# EAGLE board STEP800_proto_r3 (EAGLE 9.5.2), part 1 of 3
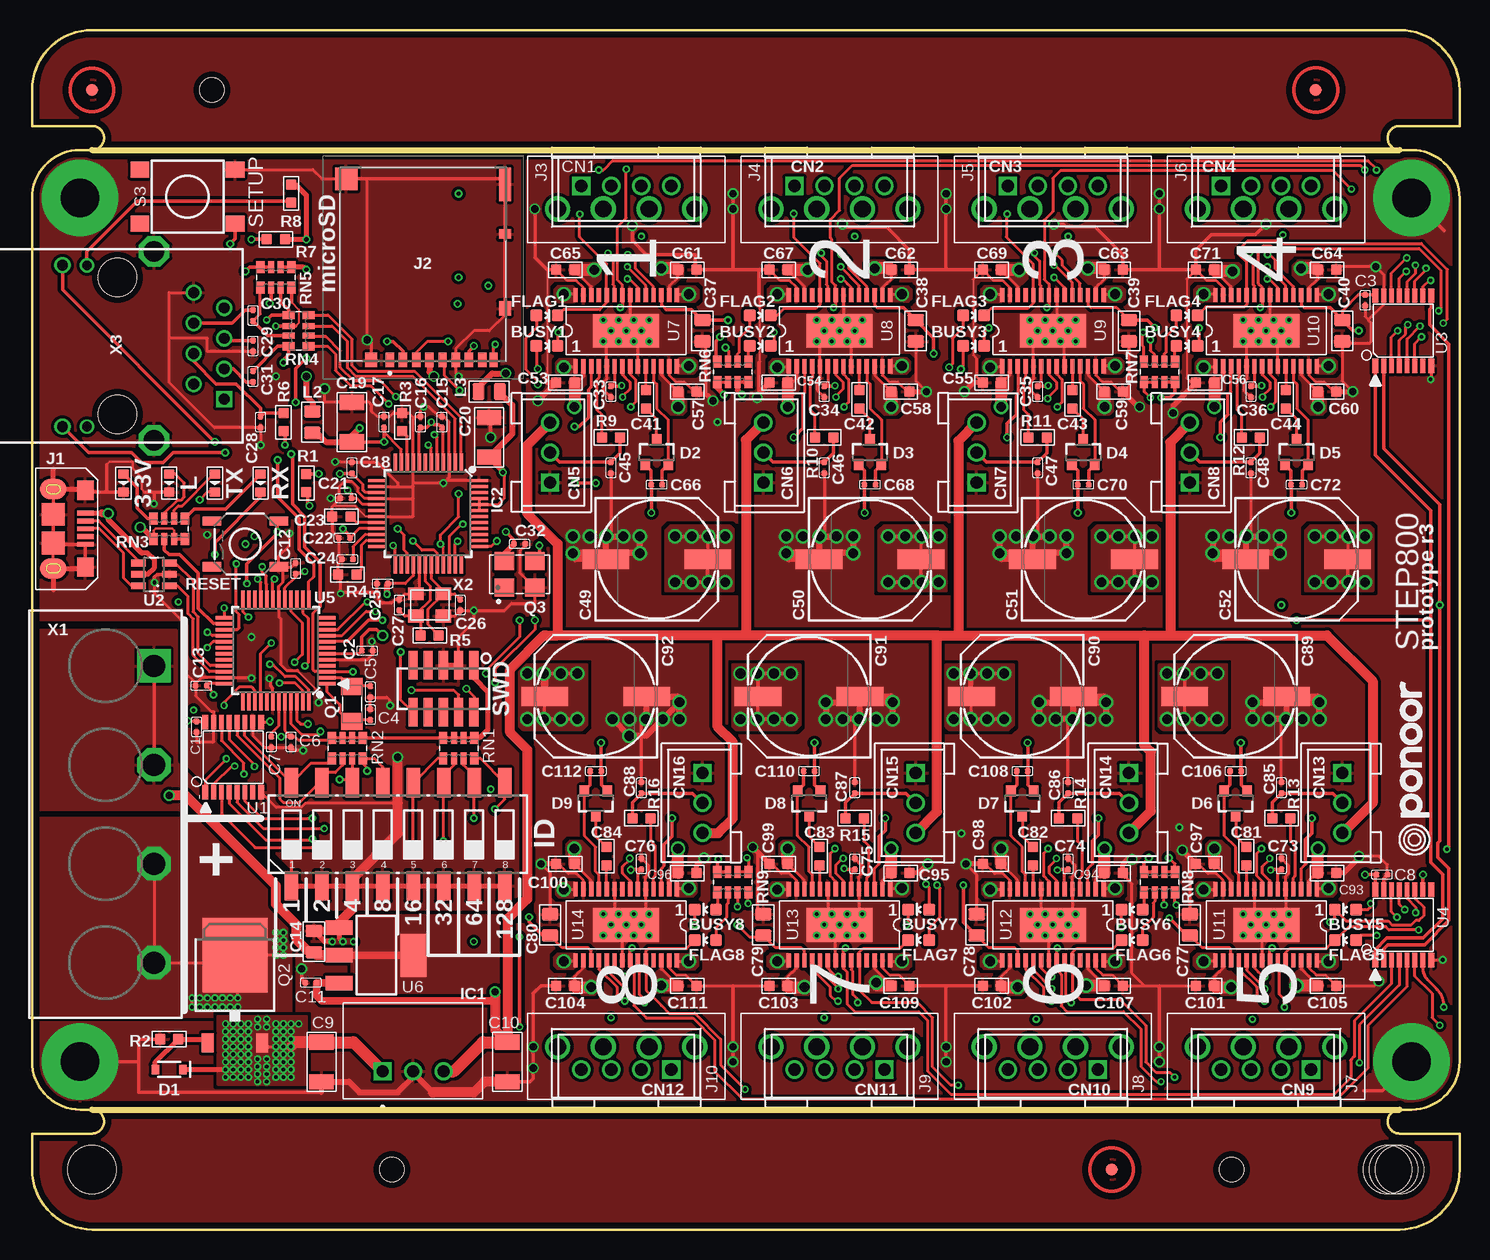
[diagram p3: board, top side]
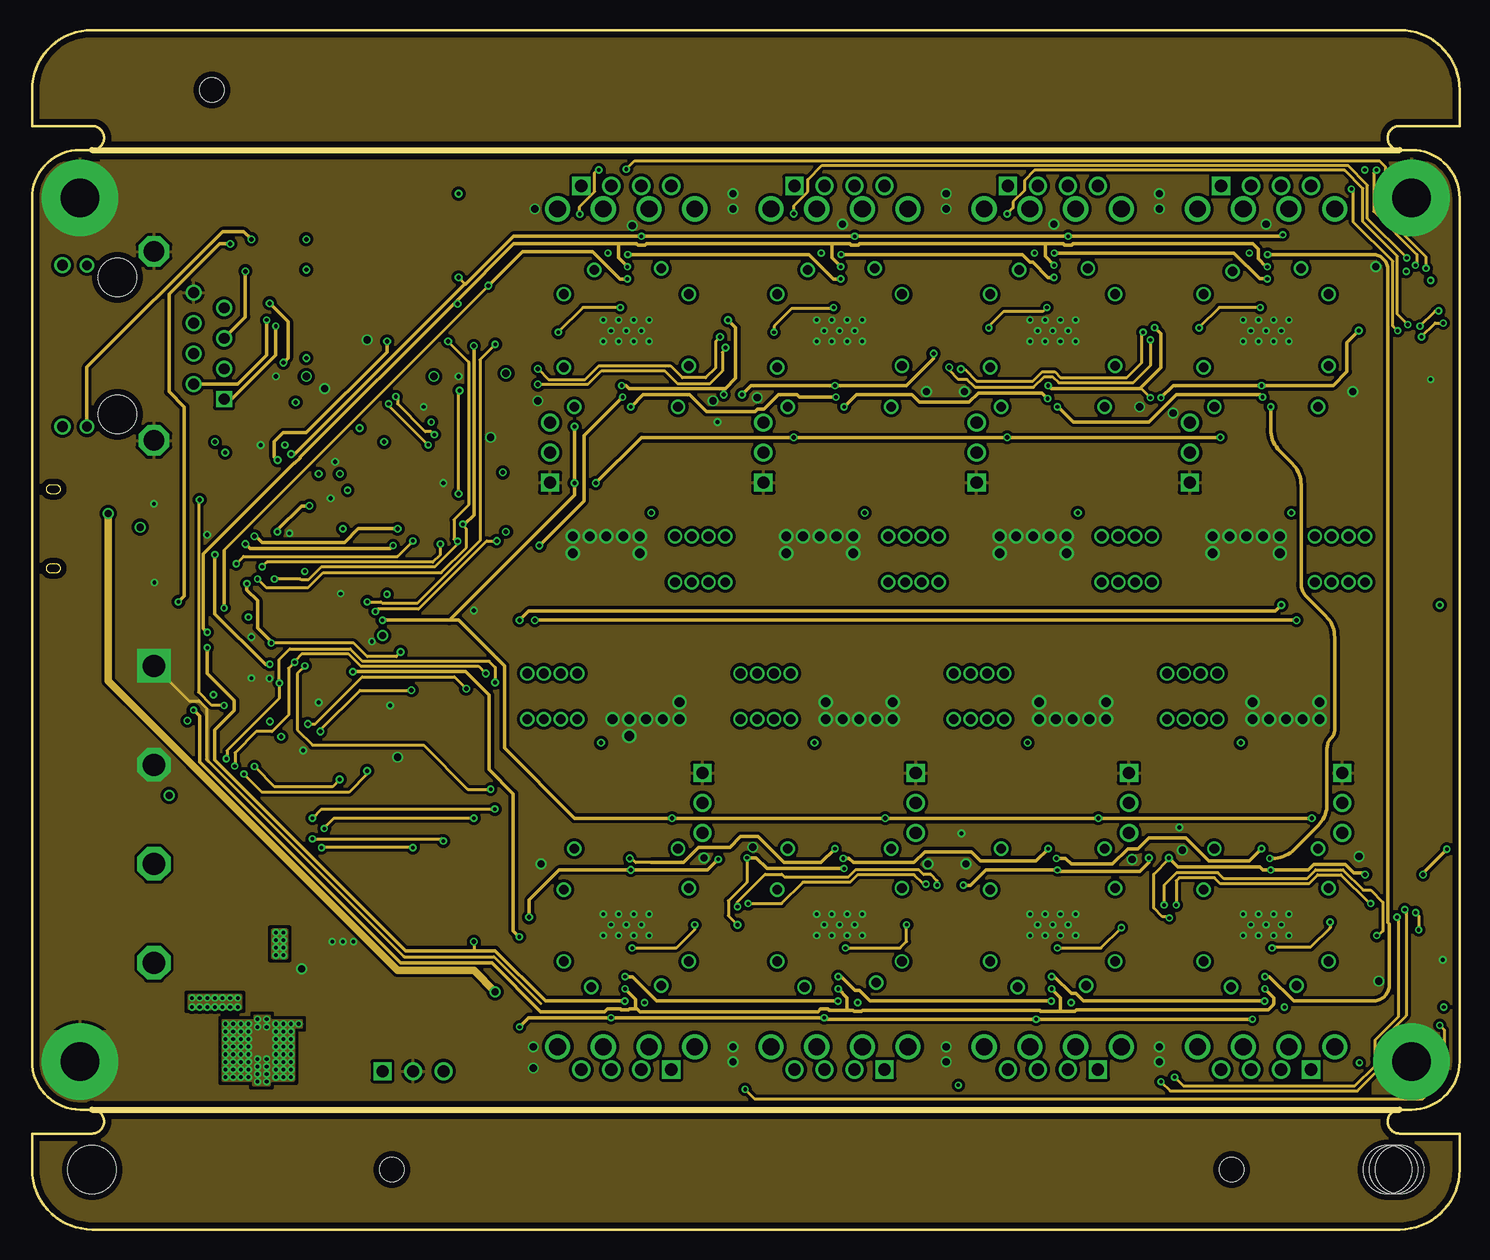
[diagram p4: board, inner layer Route2]
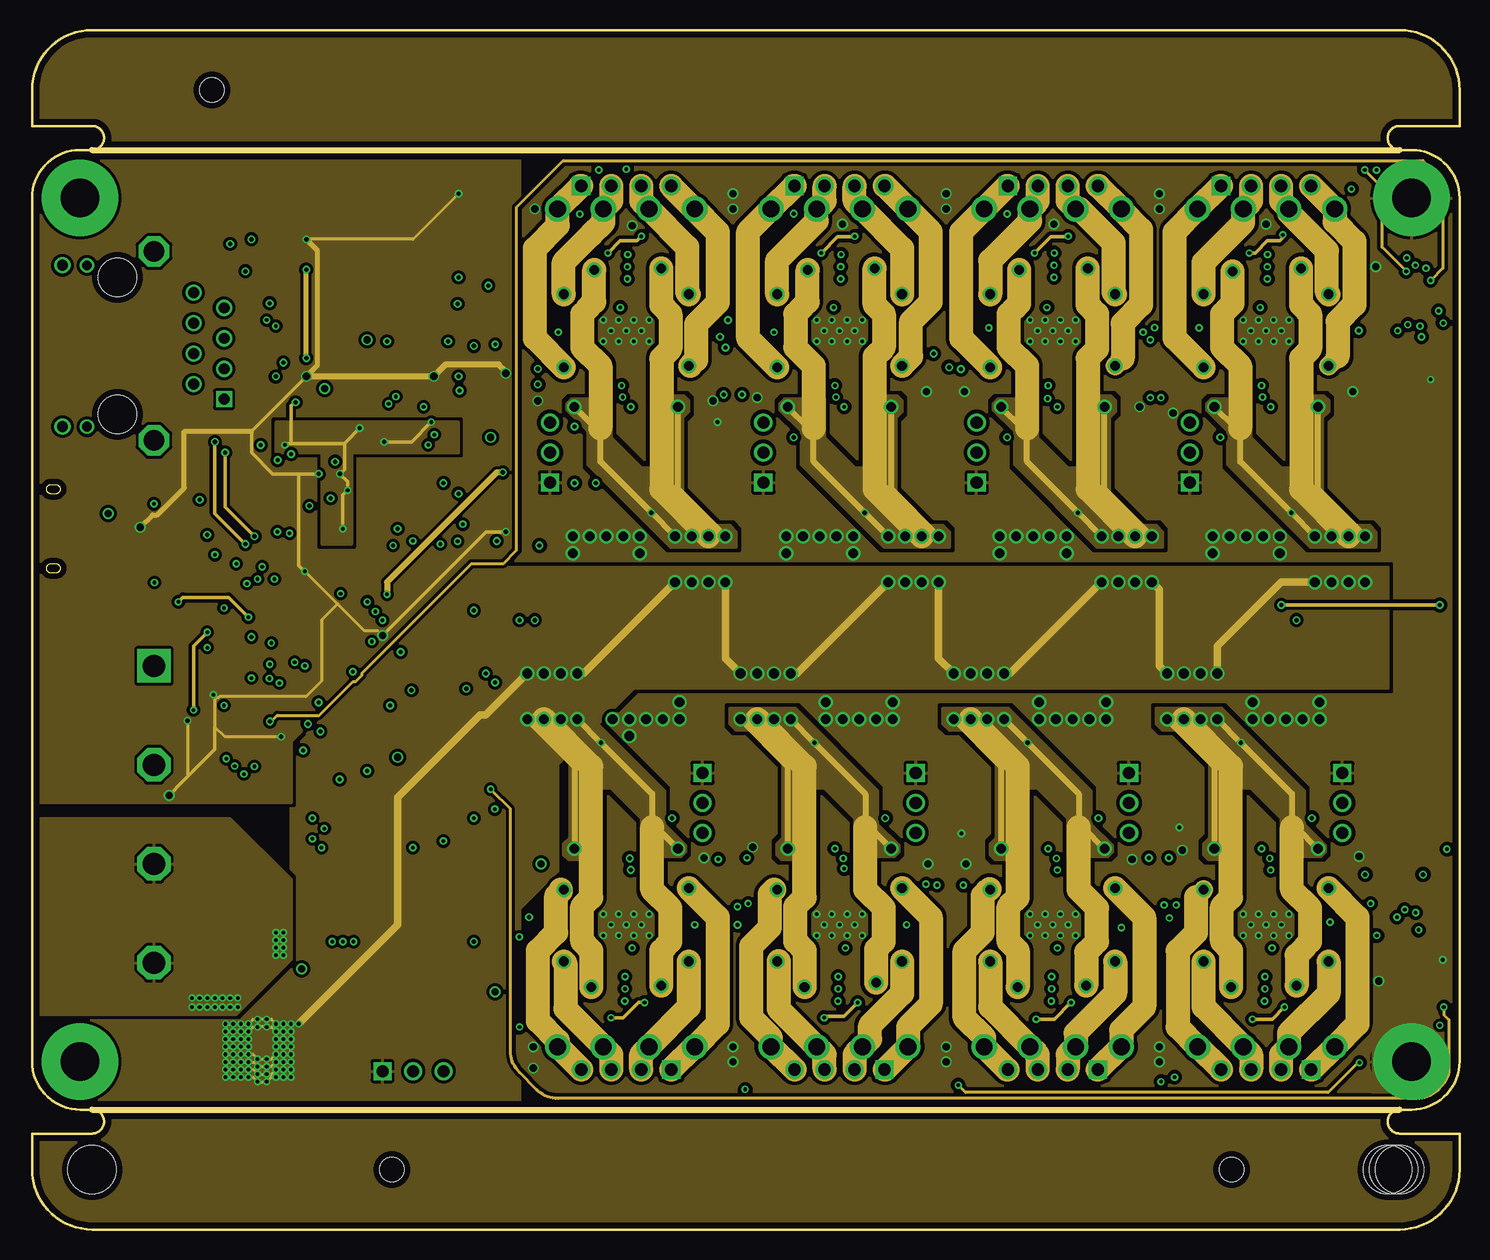
[diagram p5: board, inner layer Route15]
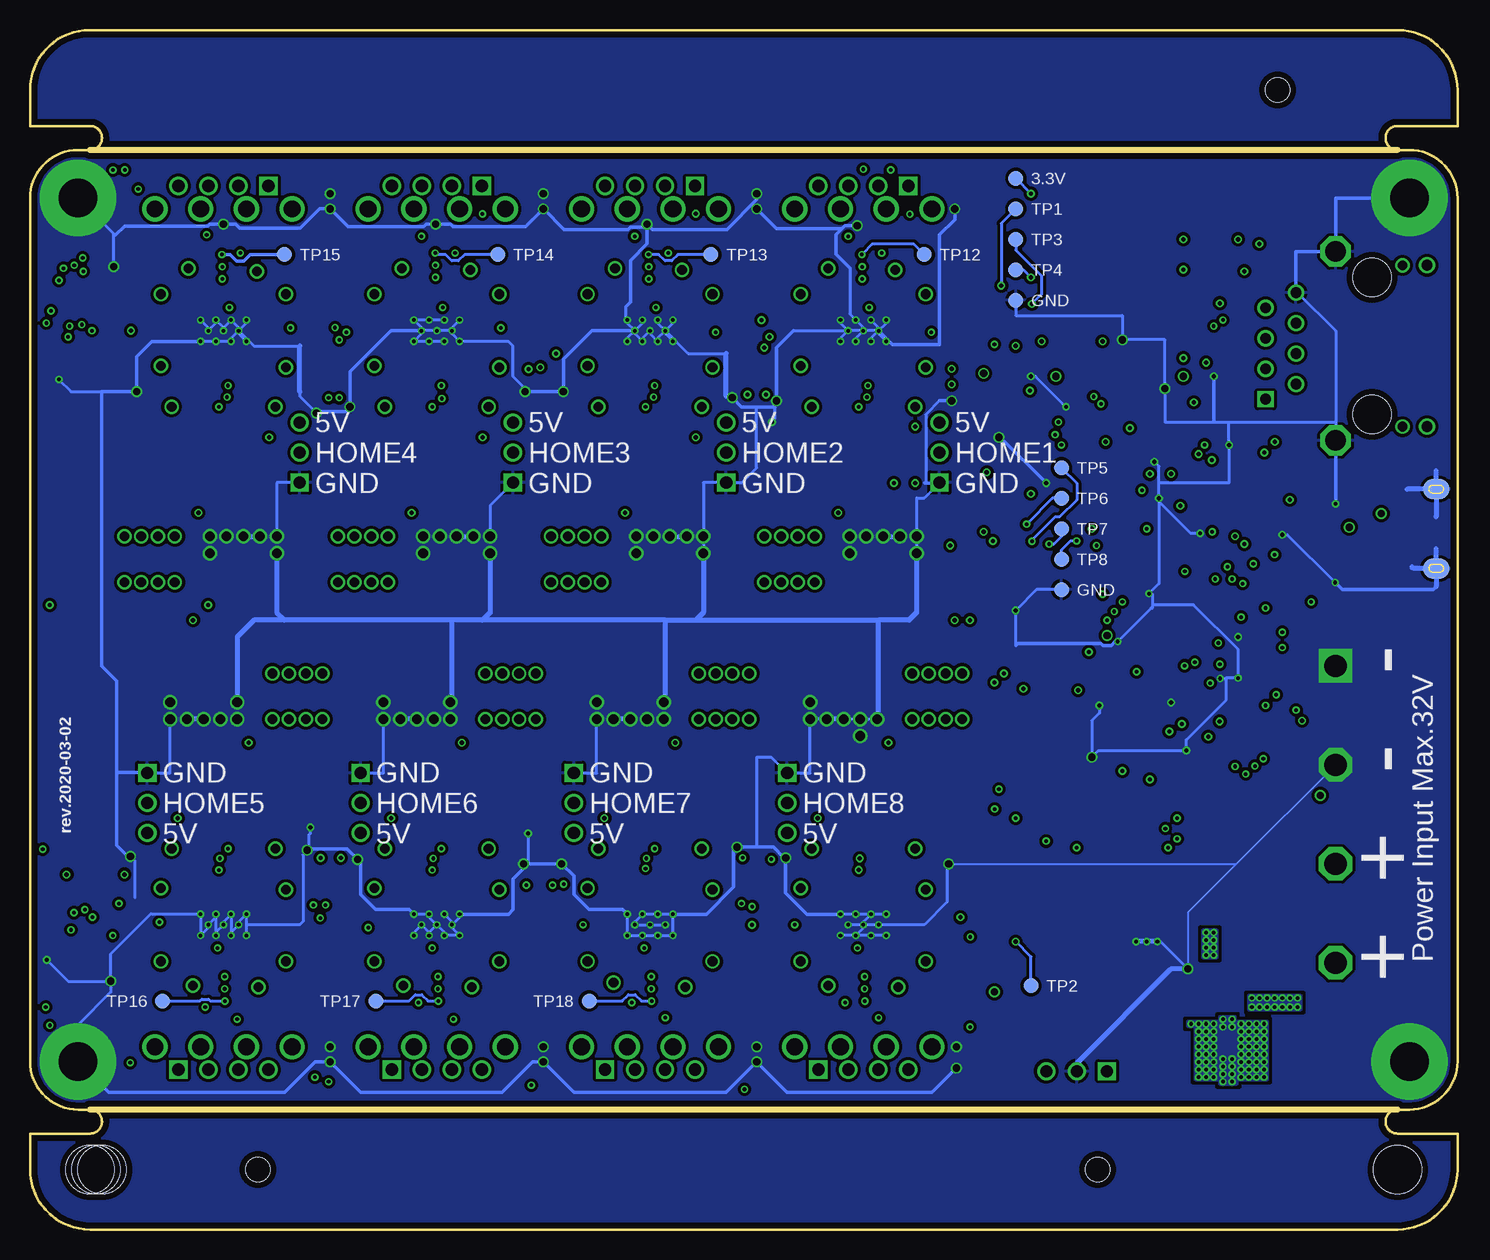
[diagram p6: board, bottom side, seen from below]

Size 119 x 100 mm. Coordinates in mm from the lower left corner, seen from the top.
Outline: 5,90 114,90
Outline: 5,10 114,10
Outline: 5,90 arc90 6,91 arc90 5,92 0,92 0,95 arc-90 5,100 114,100 arc-90 119,95 119,92 114,92 arc90 113,91 arc90 114,90
Outline: 5,90 4,90 arc90 0,86 0,14 arc90 4,10 5,10
Outline: 5,10 arc-90 6,9 arc-90 5,8 0,8 0,5 arc90 5,0 114,0 arc90 119,5 119,8 114,8 arc-90 113,9 arc-90 114,10
Outline: 114,10 115,10 arc90 119,14 119,86 arc90 115,90 114,90
Copper layers (1+2*15+16): Top 0.018mm / dielectric 0.25mm / Route2 0.035mm / dielectric 1mm / Route15 0.035mm / dielectric 0.25mm / Bottom 0.018mm
Design rules "pban_5mil-l4": minimum track width 5mil, minimum drill 0.3mm, track to track 5mil, track to pad 0.229mm, pad to pad 5mil, via to via 5mil, smd to smd 5mil, copper to edge 0.5mm, drill to drill 0.5mm, minimum pad ring 0.15mm, minimum via ring 0.15mm, stop-mask expansion 4mil, vias tented up to drill 0.35mm, thermal gap 10mil
Holes 2.05 mm at 15,95 100,5 30,5
Holes 4 mm at 5,5 114,5 113,5 113.5,5
tRestrict: area 3.3,93.3 to 6.7,96.7; area 88.3,3.3 to 91.7,6.7; area 105.3,93.3 to 108.7,96.7

## Footprints (pad centres in the part's own frame; a part is rotated, then mirrored left to right if it is on the bottom)
LED-0603 = smd 0.762 x 0.889: + -0.762,0; - 0.762,0
LED-0603' = smd 1 x 1: A 0,-0.877; C 0,0.877
C0402 = smd 0.5 x 0.5: 1 0,0.463; 2 0,-0.463
C1206 = smd 1.27 x 2.032: 1 -1.651,0; 2 1.651,0
C0805 = smd 1.397 x 1.016: 1 0,0.889; 2 0,-0.889
C0603 = smd 0.889 x 0.889: 1 0,0.762; 2 0,-0.762
NICHICON_D10 = smd 3.9 x 1.6: + 4.25,0; - -4.25,0
B4B-XASK-1 = drill 1.016 square: 1 -3.75,0 | drill 1.016: 2 -1.25,0; 3 1.25,0; 4 3.75,0
B3B-XASK-1 = drill 1.016 square: 1 -2.5,0 | drill 1.016: 2 0,0; 3 2.5,0
SOD-323 = smd 0.63 x 0.83: A 1.15,0; C -1.15,0
SOT23-3 = smd 0.8 x 0.9: 1 -0.95,-1; 2 0.95,-1; 3 0,1.1
FIDUCIAL-1X2 = smd 1 x 1: 1 0,0
CONV_P78E05-1000 = drill 1 square: 1 -2.54,0 | drill 1: 2 0,0; 3 2.54,0
TQFP48-LONG = smd 1.5 x 0.28: 1 -4.25,2.75; 2 -4.25,2.25; 3 -4.25,1.75; 4 -4.25,1.25; 5 -4.25,0.75; 6 -4.25,0.25; 7 -4.25,-0.25; 8 -4.25,-0.75; 9 -4.25,-1.25; 10 -4.25,-1.75; 11 -4.25,-2.25; 12 -4.25,-2.75; 25 4.25,-2.75; 26 4.25,-2.25; 27 4.25,-1.75; 28 4.25,-1.25; 29 4.25,-0.75; 30 4.25,-0.25; 31 4.25,0.25; 32 4.25,0.75; 33 4.25,1.25; 34 4.25,1.75; 35 4.25,2.25; 36 4.25,2.75 | smd 0.28 x 1.5: 13 -2.75,-4.25; 14 -2.25,-4.25; 15 -1.75,-4.25; 16 -1.25,-4.25; 17 -0.75,-4.25; 18 -0.25,-4.25; 19 0.25,-4.25; 20 0.75,-4.25; 21 1.25,-4.25; 22 1.75,-4.25; 23 2.25,-4.25; 24 2.75,-4.25; 37 2.75,4.25; 38 2.25,4.25; 39 1.75,4.25; 40 1.25,4.25; 41 0.75,4.25; 42 0.25,4.25; 43 -0.25,4.25; 44 -0.75,4.25; 45 -1.25,4.25; 46 -1.75,4.25; 47 -2.25,4.25; 48 -2.75,4.25
CTS-219-08 = smd 1.13 x 2.44: 1 -8.89,-4.3; 2 -6.35,-4.3; 3 -3.81,-4.3; 4 -1.27,-4.3; 5 1.27,-4.3; 6 3.81,-4.3; 7 6.35,-4.3; 8 8.89,-4.3; 9 8.89,4.3; 10 6.35,4.3; 11 3.81,4.3; 12 1.27,4.3; 13 -1.27,4.3; 14 -3.81,4.3; 15 -6.35,4.3; 16 -8.89,4.3
MICROUSB-FCI-PBAN = smd 0.4 x 1.35: 1 -1.3,1.27; 2 -0.65,1.27; 3 0,1.27; 4 0.65,1.27; 5 1.3,1.27 | smd 1.7 x 2.2: S1 -3.3,-1.4; S2 3.3,-1.4 | smd 1.6 x 1.4: S3 -3.2,1.27; S4 3.2,1.27 | smd 1.9 x 1.9: S5 -1.2,-1.405; S6 1.2,-1.405 | smd 1.7 x 2.2 bottom: S7 -3.3,-1.4; S8 3.3,-1.4
DM3ATSFPEJM542 = smd 0.7 x 1.2: 1 3.2,-0.1; 2 2.1,-0.1; 3 1,-0.1; 4 -0.1,-0.1; 5 -1.2,-0.1; 6 -2.3,-0.1; 7 -3.4,-0.1; 8 -4.5,-0.1; 9 -5.45,-0.1 | smd 1 x 1.2: 10 4.75,-0.1; 14 -6.4,-4.4 | smd 1.85 x 1.9: 11 6.825,-15.2 | smd 1 x 2.8: 12 -6.4,-14.75 | smd 1 x 0.8: 13 -6.4,-10.6
691321300004 = drill 1.4: 1 -5.715,0; 2 -1.905,0; 3 1.905,0; 4 5.715,0
L0805 = smd 1.016 x 1.397: 1 -0.889,0; 2 0.889,0
FC-135 = smd 1.4 x 1.8: P$1 -1.45,0; P$2 1.45,0
TO252 = smd 1 x 1.6: 1 -2.28,-4.8; 2 2.28,-4.8 | smd 5.4 x 6.2: 3 0,2.5
SG5032 = smd 1.5 x 1.6: 1 -1.1,1.27; 2 -1.1,-1.27; 3 1.1,-1.27; 4 1.1,1.27
R0603 = smd 0.889 x 0.889: 1 0,0.762; 2 0,-0.762
TACTILE-SWITCH-SMD = smd 1.524 x 0.762: 1 -2.794,1.905; 2 2.794,1.905; 3 -2.794,-1.905; 4 2.794,-1.905
CAY16_LONG_W = smd 0.7 x 1: 1 -1.3,-0.85; 4 1.3,-0.85; 5 1.3,0.85; 8 -1.3,0.85 | smd 0.5 x 1: 2 -0.4,-0.85; 3 0.4,-0.85; 6 0.4,0.85; 7 -0.4,0.85
TACTILE_SWITCH_SMD_6.2MM_TALL = smd 1.55 x 1.3: A1 -3.975,-2.25; A2 3.975,-2.25; B1 -3.975,2.25; B2 3.975,2.25
STANDOFF-ELECTRICAL = drill 3.2 pad 6.35: P1 0,0
20021121-00010C4LF = smd 0.762 x 2.388: P$1 -2.54,-1.956; P$2 -2.54,1.956; P$3 -1.27,-1.956; P$4 -1.27,1.956; P$5 0,-1.956; P$6 0,1.956; P$7 1.27,-1.956; P$8 1.27,1.956; P$9 2.54,-1.956; P$10 2.54,1.956
PAD.03X.05 = smd 1.27 x 1.27: P$1 0,0
TSSOP16 = smd 0.5 x 1.2: 1 -2.325,-2.925; 8 2.325,-2.925; 9 2.325,2.925; 16 -2.325,2.925 | smd 0.4 x 1.2: 2 -1.625,-2.925; 3 -0.975,-2.925; 4 -0.325,-2.925; 5 0.325,-2.925; 6 0.975,-2.925; 7 1.625,-2.925; 10 1.625,2.925; 11 0.975,2.925; 12 0.325,2.925; 13 -0.325,2.925; 14 -0.975,2.925; 15 -1.625,2.925
SOT23-6L = smd 0.55 x 1.2: 1 -0.95,-1.3; 2 0,-1.3; 3 0.95,-1.3; 4 0.95,1.3; 5 0,1.3; 6 -0.95,1.3
TQFP-48 = smd 1.5 x 0.28: 1 -4.25,2.75; 2 -4.25,2.25; 3 -4.25,1.75; 4 -4.25,1.25; 5 -4.25,0.75; 6 -4.25,0.25; 7 -4.25,-0.25; 8 -4.25,-0.75; 9 -4.25,-1.25; 10 -4.25,-1.75; 11 -4.25,-2.25; 12 -4.25,-2.75; 25 4.25,-2.75; 26 4.25,-2.25; 27 4.25,-1.75; 28 4.25,-1.25; 29 4.25,-0.75; 30 4.25,-0.25; 31 4.25,0.25; 32 4.25,0.75; 33 4.25,1.25; 34 4.25,1.75; 35 4.25,2.25; 36 4.25,2.75 | smd 0.28 x 1.5: 13 -2.75,-4.25; 14 -2.25,-4.25; 15 -1.75,-4.25; 16 -1.25,-4.25; 17 -0.75,-4.25; 18 -0.25,-4.25; 19 0.25,-4.25; 20 0.75,-4.25; 21 1.25,-4.25; 22 1.75,-4.25; 23 2.25,-4.25; 24 2.75,-4.25; 37 2.75,4.25; 38 2.25,4.25; 39 1.75,4.25; 40 1.25,4.25; 41 0.75,4.25; 42 0.25,4.25; 43 -0.25,4.25; 44 -0.75,4.25; 45 -1.25,4.25; 46 -1.75,4.25; 47 -2.25,4.25; 48 -2.75,4.25
SOT223 = smd 1.219 x 2.235: 1 -2.311,-3.099; 2 0,-3.099; 3 2.311,-3.099 | smd 3.6 x 2.2: 4 0,3.099
HTSSOP28_VIA = smd 0.36 x 1.19: 1 -4.225,-2.97; 2 -3.575,-2.97; 3 -2.925,-2.97; 4 -2.275,-2.97; 5 -1.625,-2.97; 6 -0.975,-2.97; 7 -0.325,-2.97; 8 0.325,-2.97; 9 0.975,-2.97; 10 1.625,-2.97; 11 2.275,-2.97; 12 2.925,-2.97; 13 3.575,-2.97; 14 4.225,-2.97; 15 4.225,2.97; 16 3.575,2.97; 17 2.925,2.97; 18 2.275,2.97; 19 1.625,2.97; 20 0.975,2.97; 21 0.325,2.97; 22 -0.325,2.97; 23 -0.975,2.97; 24 -1.625,2.97; 25 -2.275,2.97; 26 -2.925,2.97; 27 -3.575,2.97; 28 -4.225,2.97 | smd 5.5 x 2.8: 29 0,0 | drill 0.3: VIA1 -1.905,0.889; VIA2 -0.635,0.889; VIA3 0.635,0.889; VIA4 1.905,0.889; VIA5 -1.27,0; VIA6 0,0; VIA7 1.27,0; VIA8 -1.905,-0.889; VIA9 -0.635,-0.889; VIA10 0.635,-0.889; VIA11 1.905,-0.889
OSTYK42104030 = drill 1.85 square: P$1 0,0 | drill 1.85 octagon: P$2 8.25,0; P$3 16.5,0; P$4 24.75,0
CRYSTAL-3.2-2.5 = smd 1.3 x 1.05: 1 -1.15,-0.925; 2 1.15,-0.925; 3 1.15,0.925; 4 -1.15,0.925
HR871181A = drill 0.9 square: 1 -4.44,-8.89 | drill 0.9: 2 -3.175,-6.35; 3 -1.905,-8.89; 4 -0.635,-6.35; 5 0.635,-8.89; 6 1.905,-6.35; 7 3.175,-8.89; 8 4.445,-6.35; 10 -6.725,4.57; 12 6.725,4.57 | drill 0.8: 9 -6.725,2.54; 11 6.725,2.54 | drill 1.7 octagon: SHIELD1 -7.875,-3.05; SHIELD2 7.875,-3.05 | hole 3.2: -5.715,0; 5.715,0

## Placement (x,y rotation side)
3.3V  GREEN-0603  [LED-0603]  7.62,62.23 270 top
BUSY1  GREEN  [LED-0603']  42.93,73.66 270 top
BUSY2  GREEN  [LED-0603']  60.71,73.66 270 top
BUSY3  GREEN  [LED-0603']  78.49,73.66 270 top
BUSY4  GREEN  [LED-0603']  96.27,73.66 270 top
BUSY5  GREEN  [LED-0603']  109.47,26.67 90 top
BUSY6  GREEN  [LED-0603']  91.69,26.67 90 top
BUSY7  GREEN  [LED-0603']  73.91,26.67 90 top
BUSY8  GREEN  [LED-0603']  56.13,26.67 90 top
C1  100nf  [C0402]  13.72,41.91 0 top
C2  100nf  [C0402]  27.94,48.26 90 top
C3  100nf  [C0402]  111.12,77.47 0 top
C4  22pF  [C0402]  28.19,42.93 0 top
C5  22pF  [C0402]  28.19,44.83 0 top
C6  100nf  [C0402]  21.59,40.64 0 top
C7  100nf  [C0402]  19.94,40.64 0 top
C8  100nf  [C0402]  112.52,29.59 90 top
C9  10uF/50V  [C1206]  24.13,13.97 90 top
C10  22uF/10V  [C1206]  39.62,13.97 90 top
C11  100nf  [C0402]  23.24,20.57 270 top
C12  100nf  [C0402]  21.97,55.12 180 top
C13  100nf  [C0402]  14.1,45.34 270 top
C14  10uF/10V  [C0805]  23.5,24 0 top
C15  100nf  [C0402]  34.16,67.31 180 top
C16  100nf  [C0402]  32.38,67.31 180 top
C17  100nf  [C0402]  29.34,67.31 180 top
C18  100nf  [C0402]  26.67,63.5 180 top
C19  47uF/6.3V  [C1206]  26.67,67.31 90 top
C20  47uF/6.3V  [C1206]  38.1,66.04 90 top
C21  100nf  [C0402]  26.16,60.96 270 top
C22  100nf  [C0402]  26.04,57.66 270 top
C23  4.7uF / 6.3V  [C0603]  25.78,59.44 90 top
C24  10nf  [C0402]  26.29,55.88 90 top
C25  100nf  [C0402]  29.21,53.85 90 top
C26  22pF  [C0402]  35.69,52.07 0 top
C27  22pF  [C0402]  30.61,52.07 180 top
C28  22nF/25V  [C0402]  19.05,67.31 0 top
C29  10nf  [C0402]  18.41,73.66 0 top
C30  6.8nF  [C0402]  18.41,76.2 180 top
C31  6.8nF  [C0402]  18.41,71.12 0 top
C32  100nf  [C0402]  40.64,57.15 270 top
C33  100nf  [C0402]  48.26,69.85 0 top
C34  100nf  [C0402]  66.04,69.85 0 top
C35  100nf  [C0402]  83.82,69.85 0 top
C36  100nf  [C0402]  101.6,69.85 0 top
C37  10uf  [C0805]  55.88,74.93 180 top
C38  10uf  [C0805]  73.66,74.93 180 top
C39  10uf  [C0805]  91.44,74.93 180 top
C40  10uf  [C0805]  109.22,74.93 180 top
C41  220nf  [C0603]  51.18,69.22 180 top
C42  220nf  [C0603]  68.96,69.22 180 top
C43  220nf  [C0603]  86.74,69.22 180 top
C44  220nf  [C0603]  104.52,69.22 180 top
C45  10nf  [C0402]  48.26,63.5 180 top
C46  10nf  [C0402]  66.04,63.5 180 top
C47  10nf  [C0402]  83.82,63.5 180 top
C48  10nf  [C0402]  101.6,63.5 180 top
C49  330uF, 35V  [NICHICON_D10]  52.07,55.88 0 top
C50  330uF, 35V  [NICHICON_D10]  69.85,55.88 0 top
C51  330uF, 35V  [NICHICON_D10]  87.63,55.88 0 top
C52  330uF, 35V  [NICHICON_D10]  105.41,55.88 0 top
C53  100nf  [C0603]  44.45,70.61 90 top
C54  100nf  [C0603]  62.23,70.61 90 top
C55  100nf  [C0603]  80.01,70.61 90 top
C56  100nf  [C0603]  97.79,70.61 90 top
C57  100nf  [C0603]  54.61,69.85 270 top
C58  100nf  [C0603]  72.39,69.85 270 top
C59  100nf  [C0603]  90.17,69.85 270 top
C60  100nf  [C0603]  107.95,69.85 270 top
C61  100nf  [C0603]  54.61,80.01 270 top
C62  100nf  [C0603]  72.39,80.01 270 top
C63  100nf  [C0603]  90.17,80.01 270 top
C64  100nf  [C0603]  107.95,80.01 270 top
C65  100nf  [C0603]  44.45,80.01 90 top
C66  10nf  [C0402]  52.07,62.1 270 top
C67  100nf  [C0603]  62.23,80.01 90 top
C68  10nf  [C0402]  69.85,62.1 270 top
C69  100nf  [C0603]  80.01,80.01 90 top
C70  10nf  [C0402]  87.63,62.1 270 top
C71  100nf  [C0603]  97.79,80.01 90 top
C72  10nf  [C0402]  105.41,62.1 270 top
C73  100nf  [C0402]  104.14,30.48 180 top
C74  100nf  [C0402]  86.36,30.48 180 top
C75  100nf  [C0402]  68.58,30.48 180 top
C76  100nf  [C0402]  50.8,30.48 180 top
C77  10uf  [C0805]  96.52,25.4 0 top
C78  10uf  [C0805]  78.74,25.4 0 top
C79  10uf  [C0805]  60.96,25.4 0 top
C80  10uf  [C0805]  43.18,25.4 0 top
C81  220nf  [C0603]  101.22,31.11 0 top
C82  220nf  [C0603]  83.44,31.11 0 top
C83  220nf  [C0603]  65.66,31.11 0 top
C84  220nf  [C0603]  47.88,31.11 0 top
C85  10nf  [C0402]  104.14,36.83 0 top
C86  10nf  [C0402]  86.36,36.83 0 top
C87  10nf  [C0402]  68.58,36.83 0 top
C88  10nf  [C0402]  50.8,36.83 0 top
C89  330uF, 35V  [NICHICON_D10]  100.33,44.45 180 top
C90  330uF, 35V  [NICHICON_D10]  82.55,44.45 180 top
C91  330uF, 35V  [NICHICON_D10]  64.77,44.45 180 top
C92  330uF, 35V  [NICHICON_D10]  46.99,44.45 180 top
C93  100nf  [C0603]  107.95,29.72 270 top
C94  100nf  [C0603]  90.17,29.72 270 top
C95  100nf  [C0603]  72.39,29.72 270 top
C96  100nf  [C0603]  54.61,29.72 270 top
C97  100nf  [C0603]  97.79,30.48 90 top
C98  100nf  [C0603]  80.01,30.48 90 top
C99  100nf  [C0603]  62.23,30.48 90 top
C100  100nf  [C0603]  44.45,30.48 90 top
C101  100nf  [C0603]  97.79,20.32 90 top
C102  100nf  [C0603]  80.01,20.32 90 top
C103  100nf  [C0603]  62.23,20.32 90 top
C104  100nf  [C0603]  44.45,20.32 90 top
C105  100nf  [C0603]  107.95,20.32 270 top
C106  10nf  [C0402]  100.33,38.23 90 top
C107  100nf  [C0603]  90.17,20.32 270 top
C108  10nf  [C0402]  82.55,38.23 90 top
C109  100nf  [C0603]  72.39,20.32 270 top
C110  10nf  [C0402]  64.77,38.23 90 top
C111  100nf  [C0603]  54.61,20.32 270 top
C112  10nf  [C0402]  46.99,38.23 90 top
CN1  [B4B-XASK-1]  49.53,87 0 top
CN2  [B4B-XASK-1]  67.31,87 0 top
CN3  [B4B-XASK-1]  85.09,87 0 top
CN4  [B4B-XASK-1]  102.87,87 0 top
CN5  [B3B-XASK-1]  43.18,64.77 90 top
CN6  [B3B-XASK-1]  60.96,64.77 90 top
CN7  [B3B-XASK-1]  78.74,64.77 90 top
CN8  [B3B-XASK-1]  96.52,64.77 90 top
CN9  [B4B-XASK-1]  102.87,13.34 180 top
CN10  [B4B-XASK-1]  85.09,13.34 180 top
CN11  [B4B-XASK-1]  67.31,13.34 180 top
CN12  [B4B-XASK-1]  49.53,13.34 180 top
CN13  [B3B-XASK-1]  109.22,35.56 270 top
CN14  [B3B-XASK-1]  91.44,35.56 270 top
CN15  [B3B-XASK-1]  73.66,35.56 270 top
CN16  [B3B-XASK-1]  55.88,35.56 270 top
D1  5.1V  [SOD-323]  11.43,13.34 180 top
D2  BAV99  [SOT23-3]  52.07,64.77 0 top
D3  BAV99  [SOT23-3]  69.85,64.77 0 top
D4  BAV99  [SOT23-3]  87.63,64.77 0 top
D5  BAV99  [SOT23-3]  105.41,64.77 0 top
D6  BAV99  [SOT23-3]  100.33,35.56 180 top
D7  BAV99  [SOT23-3]  82.55,35.56 180 top
D8  BAV99  [SOT23-3]  64.77,35.56 180 top
D9  BAV99  [SOT23-3]  46.99,35.56 180 top
FD1  FIDUCIAL1X2  [FIDUCIAL-1X2]  90,5 0 top
FD2  FIDUCIAL1X2  [FIDUCIAL-1X2]  5,95 0 top
FD3  FIDUCIAL1X2  [FIDUCIAL-1X2]  107,95 0 top
FLAG1  RED  [LED-0603']  42.93,76.2 270 top
FLAG2  RED  [LED-0603']  60.71,76.2 270 top
FLAG3  RED  [LED-0603']  78.49,76.2 270 top
FLAG4  RED  [LED-0603']  96.27,76.2 270 top
FLAG5  RED  [LED-0603']  109.47,24.13 90 top
FLAG6  RED  [LED-0603']  91.69,24.13 90 top
FLAG7  RED  [LED-0603']  73.91,24.13 90 top
FLAG8  RED  [LED-0603']  56.13,24.13 90 top
IC1  P78E05-1000  [CONV_P78E05-1000]  31.75,13.21 0 top
IC2  0982_W5500LONG  [TQFP48-LONG]  33.02,59.69 270 top
ID  219-08  [CTS-219-08]  30.51,32.95 0 top
J1  [MICROUSB-FCI-PBAN]  3.17,58.42 270 top
J2  DM3AT-SF-PEJM5(42)  [DM3ATSFPEJM542]  33.02,72.39 180 top
J3  691321300004  [691321300004]  49.53,85.09 0 top
J4  691321300004  [691321300004]  67.31,85.09 0 top
J5  691321300004  [691321300004]  85.09,85.09 0 top
J6  691321300004  [691321300004]  102.87,85.09 0 top
J7  691321300004  [691321300004]  102.87,15.24 180 top
J8  691321300004  [691321300004]  85.09,15.24 180 top
J9  691321300004  [691321300004]  67.31,15.24 180 top
J10  691321300004  [691321300004]  49.53,15.24 180 top
L  BLUE-0603  [LED-0603]  11.43,62.23 270 top
L2  330R-1500MA  [L0805]  23.37,67.31 270 top
L3  330R-1500MA  [L0805]  38.1,69.85 0 top
Q1  32.768kHz  [FC-135]  26.67,43.81 270 top
Q2  FDD4141TO252  [TO252]  16.92,20.37 0 top
Q3  [SG5032]  40.64,54.61 90 top
R1  10K 1/10W  [R0603]  22.86,62.23 180 top
R2  100K 1/10W  [R0603]  11.43,15.88 90 top
R3  12.4K  [R0603]  30.86,67.31 0 top
R4  10K 1/10W  [R0603]  26.29,54.61 90 top
R5  1M 1/10W  [R0603]  33.15,49.53 270 top
R6  10R  [R0603]  20.95,67.31 0 top
R7  330R  [R0603]  20.32,82.55 90 top
R8  330R  [R0603]  21.59,86.36 180 top
R9  100R  [R0603]  48.26,66.04 90 top
R10  100R  [R0603]  66.04,66.04 90 top
R11  100R  [R0603]  83.82,66.04 90 top
R12  100R  [R0603]  101.6,66.04 90 top
R13  100R  [R0603]  104.14,34.29 270 top
R14  100R  [R0603]  86.36,34.29 270 top
R15  100R  [R0603]  68.58,34.29 270 top
R16  100R  [R0603]  50.8,34.29 270 top
RESET  RESET  [TACTILE-SWITCH-SMD]  17.78,57.15 180 top
RN1  100k  [CAY16_LONG_W]  35.56,40.13 0 top
RN2  100k  [CAY16_LONG_W]  26.29,40.13 0 top
RN3  330  [CAY16_LONG_W]  11.43,58.42 180 top
RN4  33  [CAY16_LONG_W]  22.23,74.93 270 top
RN5  49.9  [CAY16_LONG_W]  20.32,79.38 180 top
RN6  330  [CAY16_LONG_W]  58.42,71.5 0 top
RN7  330  [CAY16_LONG_W]  93.98,71.5 0 top
RN8  330  [CAY16_LONG_W]  93.98,28.96 180 top
RN9  330  [CAY16_LONG_W]  58.42,28.96 180 top
RX  RED-0603  [LED-0603]  19.05,62.23 270 top
S3  MOMENTARY-SWITCH-SPST-SMD-6.2MM-TALL  [TACTILE_SWITCH_SMD_6.2MM_TALL]  12.95,86.11 0 top
S4  STANDOFF_ELECTRICAL  [STANDOFF-ELECTRICAL]  115,14 0 top
S5  STANDOFF_ELECTRICAL  [STANDOFF-ELECTRICAL]  115,86 0 top
S6  STANDOFF_ELECTRICAL  [STANDOFF-ELECTRICAL]  4,86 0 top
S7  STANDOFF_ELECTRICAL  [STANDOFF-ELECTRICAL]  4,14 0 top
SWD  CORTEX_DEBUG_SMT  [20021121-00010C4LF]  34.29,45.09 180 top
TP1  TEST-POINT3X5  [PAD.03X.05]  36.83,85.09 0 bottom
TP2  TEST-POINT3X5  [PAD.03X.05]  35.56,20.32 0 bottom
TP3  TEST-POINT3X5  [PAD.03X.05]  36.83,82.55 0 bottom
TP4  TEST-POINT3X5  [PAD.03X.05]  36.83,80.01 0 bottom
TP5  TEST-POINT3X5  [PAD.03X.05]  33.02,63.5 0 bottom
TP6  TEST-POINT3X5  [PAD.03X.05]  33.02,60.96 0 bottom
TP7  TEST-POINT3X5  [PAD.03X.05]  33.02,58.42 0 bottom
TP8  TEST-POINT3X5  [PAD.03X.05]  33.02,55.88 0 bottom
TP9  TEST-POINT3X5  [PAD.03X.05]  36.83,87.63 0 bottom
TP10  TEST-POINT3X5  [PAD.03X.05]  36.83,77.47 0 bottom
TP11  TEST-POINT3X5  [PAD.03X.05]  33.02,53.34 0 bottom
TP12  TEST-POINT3X5  [PAD.03X.05]  44.45,81.28 0 bottom
TP13  TEST-POINT3X5  [PAD.03X.05]  62.23,81.28 0 bottom
TP14  TEST-POINT3X5  [PAD.03X.05]  80.01,81.28 0 bottom
TP15  TEST-POINT3X5  [PAD.03X.05]  97.79,81.28 0 bottom
TP16  TEST-POINT3X5  [PAD.03X.05]  107.95,19.05 0 bottom
TP17  TEST-POINT3X5  [PAD.03X.05]  90.17,19.05 0 bottom
TP18  TEST-POINT3X5  [PAD.03X.05]  72.39,19.05 0 bottom
TX  YELLOW-0603  [LED-0603]  15.24,62.23 270 top
U1  74HC165PW  [TSSOP16]  16.76,39.37 0 top
U2  USBLC6-2SC6  [SOT23-6L]  10.16,54.61 90 top
U3  74HC165PW  [TSSOP16]  114.3,74.93 0 top
U4  74HC165PW  [TSSOP16]  114.3,25.4 0 top
U5  ATSAMD21G-A  [TQFP-48]  20.32,48.26 180 top
U6  LD1117S33  [SOT223]  28.7,22.86 270 top
U7  [HTSSOP28_VIA]  49.53,74.93 0 top
U8  [HTSSOP28_VIA]  67.31,74.93 0 top
U9  [HTSSOP28_VIA]  85.09,74.93 0 top
U10  [HTSSOP28_VIA]  102.87,74.93 0 top
U11  [HTSSOP28_VIA]  102.87,25.4 180 top
U12  [HTSSOP28_VIA]  85.09,25.4 180 top
U13  [HTSSOP28_VIA]  67.31,25.4 180 top
U14  [HTSSOP28_VIA]  49.53,25.4 180 top
U$2  [PONOOR_TEXT_15MM]  116.84,30.48 90 top
X1  M04_OSTYK421  [OSTYK42104030]  10.16,46.99 270 top
X2  25MHz  [CRYSTAL-3.2-2.5]  33.15,52.07 0 top
X3  RJ45_MAGNETICS_LED_HR871181A  [HR871181A]  7.11,73.66 90 top

## Tracks (layer width: path | path; a pad name or v marks a point on that pad's centre or on a via)
1V2O
  Top 0.2: IC2.22 27.77,57.94
  Top 0.254: 27.77,57.94 26.75,56.92 C24.2
3.3V  (via drill 0.3, 0.35, 0.6)
  Top 0.2: RN3.7 11.83,58.27 11.68,58.42 10.29,58.42 10.13,58.26 RN3.5
  Top 0.254: U5.44 21.07,41.62 C6.1 21.89,41.1 22.2,40.79 24.8,40.79 RN2.8 RN2.7 RN2.6 RN2.5 | U5.36 14.73,45.51 C13.1 15.11,44.78 v15.11,44.58 | U5.17 21.07,53.5 21.97,54.4 C12.1 | U5.6 27.23,48.01 C2.1 | U1.16 14.36,42.37 C1.1 13,42.37 v12.95,42.42 | RN1.5 RN1.6 RN1.7 RN1.8
  Top 0.305: RN3.8 RN3.7 | R1.2 v23.88,62.99 | C12.1 22.05,54.74 22.61,54.74 v22.73,54.86 | C2.1 27.48,49.4 28.11,50.04 28.7,50.04 v29.21,49.53 | C6.1 20.78,41.1 v20.77,41.09 | C32.2 40.18,57.49 v39.5,58.17 | RN2.5 RN1.8
  Top 0.406: Q3.4 39.37,56.34 C32.2 | R7.2 v22.86,82.55 22.86,86.23 21.97,87.12 R8.2 | RN3.5 9.15,58.55 v9.02,58.55 | SWD.P$1 36.83,45.97 37.97,44.83 37.97,41.66 37.3,40.98 RN1.5
  Top 0.508: v22.86,71.12 22.86,69.47 23.37,68.96 L2.1 | J2.4 33.12,71.49 v33.49,71.12 | v39.5,71.37 38.35,71.37 37.21,70.23 L3.1
  Top 0.61: U6.2 U6.4
  Top 0.813: U6.2 23.75,22.86 C14.2 23.42,23.19 23.02,23.19 22.07,24.14 22.07,25.38 20.32,27.13 20.32,28.67 12.79,36.2 v11.43,36.2
  Route15 0.254: v29.21,49.53 28.84,49.9 27.73,49.9 25.48,52.15 | 25.48,52.15 22.76,54.86 v22.73,54.86 | v15.11,44.58 15.37,44.32 | v20.77,41.09 16.06,41.09 15.24,41.91 15.24,44.32 15.37,44.32 | v12.95,42.42 12.95,37.72 12.57,37.34 | 25.48,52.15 24.13,50.8 24.13,45.72 22.83,44.42 15.62,44.42 15.53,44.32 15.37,44.32 | v35.56,86.36 31.75,82.55 v22.86,82.55
  Route15 0.305: v23.88,62.99 22.23,62.99 | 22.23,62.99 20.07,62.99 18.29,64.77 18.29,66.55 v22.86,71.12 | v22.73,54.86 22.23,55.37 22.23,62.99 | v39.5,58.17 37.85,58.17 v29.21,49.53 | v11.43,36.2 12.57,37.34 15.24,40.01 15.24,41.91
  Route15 0.406: v22.86,82.55 23.75,81.66 23.75,72.01 v22.86,71.12 | v9.02,58.55 10.04,59.57 10.44,59.57 12.7,61.82 12.7,66.55 18.29,66.55
  Route15 0.508: v22.86,71.12 v33.49,71.12 34.48,72.11 38.91,72.11 39.5,71.52 v39.5,71.37
  Bottom 0.254: TP9.P$1 v35.56,86.36
  pour Route15 (isolate 0.254, rank 3): 0,90.17 40.64,90.17 40.64,55.88 36.83,55.88 21.59,40.64 21.59,35.56 0,35.56
  pour Top (isolate 0.254, no thermals): 26.67,19.05 39.37,19.05 39.37,26.16 26.67,26.16
3V_1  (via drill 0.3, 0.35)
  Top 0.254: C33.1 48.55,70.61 U7.6 | 52.83,76.71 52.45,77.08 U7.17 | 57.02,70.27 57.12,70.27 RN6.1 RN6.2
  Top 0.305: C33.1 49.1,70.31 v49.15,70.36 | 52.83,76.71 54.99,76.71 C37.2 v58.01,75.82
  Top 0.406: v57.65,69.59 57.65,69.64 57.02,70.27
  Route2 0.254: v57.65,69.59 57.65,69.97 57.78,70.1
  Route2 0.305: v49.15,70.36 49.53,70.36 49.78,70.1 57.78,70.1 58.64,70.96 58.64,75.18 v58.01,75.82
3V_2  (via drill 0.3, 0.35)
  Top 0.254: C34.1 66.33,70.61 U8.6 | 70.48,76.83 70.23,77.08 U8.17
  Top 0.305: C34.1 66.88,70.31 v66.93,70.36 | 70.48,76.83 72.64,76.83 C38.2 75.15,74.33 v75.15,73.03 | 58.8,70.65 59.35,70.65
  Top 0.406: 58.8,70.65 58.8,70.63 | v59.18,69.59 58.8,69.97 58.8,70.63 | RN6.3 58.8,70.63 | 59.35,70.65 RN6.4
  Route2 0.305: v75.15,73.03 75.15,72.61 72.9,70.36 v66.93,70.36 59.95,70.36 v59.18,69.59
3V_3  (via drill 0.3)
  Top 0.254: C35.1 84.11,70.61 U9.6 | RN7.1 92.71,70.65 | 92.71,70.65 RN7.2 | U9.17 88.02,77.08 88.27,76.83 90.42,76.83 C39.2 | v93.22,69.34 92.71,69.85 92.71,70.65
  Top 0.305: C35.1 84.66,70.31 v84.71,70.36 | v93.57,75.18 93.57,75.21 92.96,75.82 C39.2
  Route2 0.254: 92.33,70.1 92.46,70.1 v93.22,69.34
  Route2 0.305: v84.71,70.36 84.96,70.1 92.33,70.1 94.08,71.85 94.08,74.68 v93.57,75.18
3V_4  (via drill 0.3, 0.35)
  Top 0.254: C36.1 101.89,70.61 U10.6 | 106.05,76.83 105.8,77.08 U10.17 | C40.2 109.22,76.58 110.57,77.93 C3.1 111.9,77.93 U3.16
  Top 0.305: C36.1 102.44,70.31 v102.49,70.36 | 106.05,76.83 108.2,76.83 C40.2 110.11,74.93 v110.59,74.93 | RN7.3 RN7.4 95.28,69.76 94.86,69.34 v94.11,69.34
  Route2 0.305: v110.59,74.93 109.6,73.94 109.6,71.5 108.46,70.36 v102.49,70.36 95.12,70.36 v94.11,69.34
3V_5  (via drill 0.3, 0.35)
  Top 0.254: C73.1 103.84,29.72 U11.6 | RN8.2 RN8.1 95.28,30.48 v94.77,30.99 | U11.17 99.94,23.37 99.82,23.5 97.54,23.5 C77.2
  Top 0.305: C73.1 103.3,30.02 v103.25,29.97 | C77.2 96.27,24.51 v94.81,25.97 | U4.16 111.97,29.51 | 111.97,29.51 C8.1 | v111.12,29.59 111.89,29.59 111.97,29.51
  Route2 0.254: v94.81,25.97 94.71,26.06 94.24,26.06 93.5,26.8 93.5,29.62 94.82,30.94
  Route2 0.305: v94.77,30.99 94.82,30.94 95.53,30.23 102.36,30.23 102.62,29.97 v103.25,29.97 106.38,29.97 106.83,30.42 109.48,30.42 110.18,29.72 110.99,29.72 v111.12,29.59
3V_6  (via drill 0.3, 0.35)
  Top 0.254: C74.1 86.06,29.72 U12.6 | U12.17 82.17,23.25 81.92,23.5 79.76,23.5 C78.2
  Top 0.305: C74.1 85.52,30.02 v85.47,29.97 | v77.63,28.7 77.63,25.62 C78.2 | RN8.3 RN8.4 92.68,30.57 92.84,30.73 v93.09,30.99
  Route2 0.305: v77.63,28.7 78.23,28.7 79.5,29.97 v85.47,29.97 85.6,29.84 92.33,29.84 93.09,30.61 v93.09,30.99
3V_7  (via drill 0.3, 0.35)
  Top 0.254: C75.1 68.28,29.72 U13.6 | RN9.2 RN9.1 59.72,30.86 v59.59,30.99 | U13.17 64.39,23.25 64.14,23.5 61.98,23.5 C79.2 60.83,24.38 59.82,24.38 v58.8,25.4
  Top 0.305: C75.1 67.77,30.02 v67.69,30.1
  Route2 0.254: v59.59,30.99 59.59,28.96 58.04,27.4 58.04,26.16 v58.8,25.4
  Route2 0.305: v67.69,30.1 61.24,30.1 60.35,30.99 v59.59,30.99
3V_8  (via drill 0.3, 0.35)
  Top 0.254: C76.1 50.51,29.72 U14.6 | U14.17 46.6,23.25 46.35,23.5 44.2,23.5 C80.2
  Top 0.305: C76.1 49.96,30.02 v49.91,29.97 | C80.2 42.58,24.51 41.43,25.65 v41.43,26.04 | RN9.3 RN9.4 57.12,30.79 v57.19,30.86
  Route2 0.305: v41.43,26.04 41.43,27.46 43.94,29.97 v49.91,29.97 56.3,29.97 v57.19,30.86
5V  (via drill 0.6)
  Top 0.406: J1.1 5.81,59.72 | U2.5 9.65,54.61 10.16,55.12 10.16,55.88 9.65,56.39 9.14,56.39 6.35,59.18 v6.35,59.69
  Top 0.61: v6.35,59.69 5.84,59.69 5.81,59.72 | 38.61,19.05 24.13,19.05 23.7,19.48 C11.1 23.73,20.55 U6.3
  Top 0.813: 43.81,49.53 42.8,49.53 42.81,49.55 42.7,49.55 39.86,46.71 39.86,41.42 41.27,40.01 41.27,27.56 39.62,25.91 C10.2 38.61,16.64 38.61,19.05 v38.61,19.81 | 75.44,49.53 77.22,49.53 | 77.22,49.53 92.71,49.53 | 92.71,49.53 94.87,49.53 | 94.87,49.53 107.95,49.53 111.76,45.72 111.76,35.56 109.24,33.04 CN13.3 | 92.71,49.53 92.71,40.37 93.27,39.81 93.27,34.89 CN14.3 | CN15.3 75.44,34.84 75.44,49.53 | CN6.3 59.51,65.83 59.51,49.71 59.69,49.53 | CN7.3 77.22,65.75 77.22,49.53 | CN8.3 94.87,65.62 94.87,49.53 | CN5.3 41.27,65.36 41.27,59.69 43.81,57.15 43.81,49.53 | 75.44,49.53 59.69,49.53 | 59.69,49.53 57.15,49.53 | 57.15,49.53 43.81,49.53 | CN16.3 57.19,33.06 58.42,34.29 58.42,40.64 57.15,41.91 57.15,49.53
  Top 1.016: IC1.3 35.18,13.21 37.59,15.62 C10.2
  Route2 0.61: v6.35,59.69 6.35,45.72 30.48,21.59 36.83,21.59 v38.61,19.81
32V  (via drill 0.3, 0.35, 0.8)
  Top 0.254: C53.2 45.47,70.61 45.95,71.1 U7.2 | C65.2 46.6,78.62 U7.26 | C57.2 52.45,71.24 U7.12 | C61.2 53.85,79.38 53.1,78.63 U7.16 | v56.39,57.78 56.32,57.72 C49.+ | C54.2 63.37,70.61 63.73,70.97 U8.2 | C67.2 64.39,78.62 U8.26 | C58.2 70.23,71.24 U8.12 | C62.2 71.63,79.25 71.23,78.85 71.21,78.85 70.89,78.53 U8.16 | v74.17,57.78 74.1,57.72 C50.+ | C55.2 80.9,70.61 81.52,71.23 U9.2 | C69.2 82.17,78.62 U9.26 | C59.2 88.02,71.24 U9.12 | C63.2 89.41,79.25 89.01,78.85 88.99,78.85 88.67,78.53 U9.16 | v91.95,57.78 91.88,57.72 C51.+ | C56.2 98.68,70.61 99.3,71.23 U10.2 | C71.2 99.94,78.62 U10.26 | C60.2 105.8,71.24 U10.12 | C64.2 107.19,79.25 106.79,78.85 106.77,78.85 106.44,78.53 U10.16 | v109.73,57.78 109.66,57.72 C52.+ | C93.2 107.06,29.72 106.44,29.1 U11.2 | C105.2 105.8,21.71 U11.26 | C97.2 99.94,29.09 U11.12 | C101.2 98.55,21.08 98.95,21.48 98.97,21.48 99.3,21.8 U11.16 | v96.01,42.55 96.08,42.61 C89.+ | C94.2 89.15,29.72 88.67,29.23 U12.2 | C107.2 88.02,21.71 U12.26 | C98.2 82.17,29.09 U12.12 | C102.2 80.77,21.08 81.17,21.48 81.19,21.48 81.52,21.8 U12.16 | v78.23,42.55 78.3,42.61 C90.+ | C95.2 71.5,29.72 70.89,29.1 U13.2 | C109.2 70.23,21.71 U13.26 | C99.2 64.39,29.09 U13.12 | C103.2 62.99,21.08 63.39,21.48 63.41,21.48 63.73,21.8 U13.16 | v60.45,42.55 60.52,42.61 C91.+ | C96.2 53.59,29.72 53.1,29.23 U14.2 | C111.2 52.45,21.71 U14.26 | C100.2 46.6,29.09 U14.12 | C104.2 45.21,21.08 45.61,21.48 45.63,21.48 45.95,21.8 U14.16 | v42.67,42.55 42.74,42.61 C92.+ | Q2.2 19.53,15.24 v20.32,15.24
  Top 0.305: D2.1 51.61,63.28 C66.2 51.63,62.09 v51.63,59.75 | v53.59,53.98 v54.99,53.98 v56.39,53.98 | v56.39,53.98 v57.78,53.98 | v53.59,57.78 v54.99,57.78 v56.39,57.78 v57.78,57.78 | D3.1 69.39,63.28 C68.2 69.41,62.09 v69.41,59.75 | v71.37,53.98 v72.77,53.98 v74.17,53.98 | v74.17,53.98 v75.56,53.98 | v71.37,57.78 v72.77,57.78 v74.17,57.78 v75.56,57.78 | D4.1 87.17,63.28 C70.2 87.19,62.09 v87.19,59.75 | v89.15,53.98 v90.55,53.98 v91.95,53.98 | v91.95,53.98 v93.34,53.98 | v89.15,57.78 v90.55,57.78 v91.95,57.78 v93.34,57.78 | D5.1 104.95,63.28 C72.2 104.97,62.09 v104.97,59.75 | v106.93,53.98 v108.33,53.98 v109.73,53.98 | v109.73,53.98 v111.12,53.98 | v106.93,57.78 v108.33,57.78 v109.73,57.78 v111.12,57.78 | D6.1 100.79,37.05 C106.2 100.78,38.24 v100.78,40.58 | v98.81,46.35 v97.41,46.35 v96.01,46.35 | v96.01,46.35 v94.61,46.35 | v98.81,42.55 v97.41,42.55 v96.01,42.55 v94.61,42.55 | D7.1 83.01,37.05 C108.2 83,38.24 v83,40.58 | v81.03,46.35 v79.63,46.35 v78.23,46.35 v76.83,46.35 | v81.03,42.55 v79.63,42.55 v78.23,42.55 v76.83,42.55 | D8.1 65.23,37.05 C110.2 65.22,38.24 v65.22,40.58 | v63.25,46.35 v61.85,46.35 v60.45,46.35 | v60.45,46.35 v59.05,46.35 | v63.25,42.55 v61.85,42.55 v60.45,42.55 v59.05,42.55 | D9.1 47.45,37.05 C112.2 47.43,38.24 v47.43,40.58 | v45.47,46.35 v44.07,46.35 v42.67,46.35 v41.27,46.35 | v45.47,42.55 v44.07,42.55 v42.67,42.55 v41.27,42.55 | v91.95,53.98 91.88,54.04 C51.+ | C91.+ 60.52,46.29 v60.45,46.35 | v56.39,53.98 56.32,54.04 C49.+ | v74.17,53.98 74.1,54.04 C50.+ | v96.01,46.35 96.08,46.29 C89.+ | v109.73,53.98 109.66,54.04 C52.+
  Top 0.406: D1.C v16.13,13.34 | v78.23,46.35 78.23,44.52 C90.+
  Top 0.61: C92.+ 42.74,46.29 v42.67,46.35
  Top 0.813: 21.97,15.62 v21.59,15.24
  Top 1.016: C65.2 v46.86,80.01 | C61.2 53.72,80.14 v52.45,80.14 | C53.2 v45.21,68.58 | C57.2 v53.85,68.58 | C67.2 v64.64,80.01 | C62.2 71.5,80.14 v70.23,80.14 | C54.2 v62.99,68.58 | C58.2 v71.63,68.58 | C69.2 v82.3,80.01 | C63.2 89.28,80.14 v88.01,80.14 | C55.2 v80.77,68.58 | C59.2 v89.41,68.58 | v100.08,79.88 98.68,79.88 C71.2 | C64.2 107.06,80.14 v105.79,80.14 | C56.2 v98.55,68.58 | C60.2 v107.19,68.58 | C105.2 v105.41,20.32 | C101.2 98.68,20.19 v99.95,20.19 | C93.2 v107.19,31.75 | C97.2 v98.55,31.75 | C107.2 v87.88,20.32 | C102.2 80.9,20.19 v82.17,20.19 | C94.2 v89.41,31.75 | C98.2 v80.77,31.75 | C109.2 70.48,20.32 70.36,20.45 v70.36,20.57 | C103.2 63.12,20.19 v64.39,20.19 | C95.2 v71.63,31.75 | C99.2 v62.99,31.75 | C111.2 v52.45,20.32 | C104.2 45.34,20.19 v46.61,20.19 | C96.2 v53.85,31.75 | C100.2 v45.21,31.75 | 21.97,15.62 C9.2 26.8,15.62 IC1.1
  Route15 0.254: v22.23,17.14 v21.59,17.14 v20.95,17.14 v20.32,17.14 19.94,17.53 v19.56,17.53 v18.8,17.53 18.41,17.53 v18.03,17.14 v17.4,17.14 v16.76,17.14 v16.13,17.14 v16.13,16.51 | v16.13,16.51 v16.76,16.51 v17.4,16.51 v18.03,16.51 18.41,16.89 v18.8,16.89 v19.56,16.89 19.94,16.89 v20.32,16.51 v20.95,16.51 v21.59,16.51 v21.59,15.88 | v16.13,15.88 v16.76,15.88 v17.4,15.88 v18.03,15.88 | v16.13,16.51 v16.13,15.88 | v16.13,15.88 v16.13,15.24 | v16.13,15.24 v16.76,15.24 v17.4,15.24 v18.03,15.24 | v16.13,15.24 v16.13,14.61 | v16.13,14.61 v16.76,14.61 v17.4,14.61 v18.03,14.61 18.41,14.61 v18.8,14.22 v19.56,14.22 19.94,14.22 v20.32,14.61 v20.95,14.61 v21.59,14.61 v21.59,15.24 | v20.32,15.24 v20.95,15.24 v21.59,15.24 | v20.32,15.88 v20.95,15.88 v21.59,15.88 | v16.13,14.61 v16.13,13.97 | v16.13,13.97 v16.76,13.97 v17.4,13.97 v18.03,13.97 18.41,13.97 v18.8,13.59 v19.56,13.59 19.94,13.59 v20.32,13.97 v20.95,13.97 v21.59,13.97 | v16.13,13.97 v16.13,13.34 | v16.13,13.34 v16.76,13.34 v17.4,13.34 v18.03,13.34 18.41,13.34 v18.8,12.95 v19.56,12.95 19.94,12.95 v20.32,13.34 v20.95,13.34 v21.59,13.34 v21.59,12.7 v20.95,12.7 v20.32,12.7 19.94,12.7 v19.56,12.32 v18.8,12.32 18.41,12.7 v18.03,12.7 v17.4,12.7 v16.76,12.7 v16.13,12.7 v16.13,13.34 | v21.59,15.24 v21.59,15.88
  Route15 0.508: 45.85,76.33 46.23,76.71 | v53.59,57.78 v51.63,59.75 47.37,64.01 47.37,66.8 46.99,66.8 v45.21,68.58 | v57.78,57.78 53.85,61.72 v53.85,68.58 | 63.63,76.33 64.01,76.71 | v71.37,57.78 v69.41,59.75 65.15,64.01 65.15,66.8 64.77,66.8 v62.99,68.58 | v75.56,57.78 71.63,61.72 v71.63,68.58 | 81.41,76.33 81.79,76.71 | v89.15,57.78 v87.19,59.75 82.93,64.01 82.93,66.8 82.55,66.8 v80.77,68.58 | v93.34,57.78 89.41,61.72 v89.41,68.58 | 99.19,76.33 99.57,76.71 | v106.93,57.78 v104.97,59.75 100.71,64.01 100.71,66.8 100.33,66.8 v98.55,68.58 | v111.12,57.78 107.19,61.72 v107.19,68.58 | 106.55,24 106.17,23.62 | v98.81,42.55 v100.78,40.58 105.03,36.32 105.03,33.53 105.41,33.53 v107.19,31.75 | v94.61,42.55 98.55,38.61 v98.55,31.75 | 88.77,24 88.39,23.62 | v81.03,42.55 v83,40.58 87.25,36.32 87.25,33.53 87.63,33.53 v89.41,31.75 | v76.83,42.55 80.77,38.61 v80.77,31.75 | 70.99,24 70.61,23.62 | v63.25,42.55 v65.22,40.58 69.47,36.32 69.47,33.53 69.85,33.53 v71.63,31.75 | v59.05,42.55 62.99,38.61 v62.99,31.75 | 53.21,24 52.83,23.62 | v45.47,42.55 v47.43,40.58 51.69,36.32 51.69,33.53 52.07,33.53 v53.85,31.75 | v41.27,42.55 45.21,38.61 v45.21,31.75
  Route15 0.61: v93.34,53.98 93.98,53.34 93.98,46.99 v94.61,46.35 | v98.81,46.35 98.81,48.64 104.14,53.98 v106.93,53.98 | v89.15,53.98 81.53,46.35 v81.03,46.35 | v76.83,46.35 75.56,47.62 v75.56,53.98 | v71.37,53.98 63.75,46.35 v63.25,46.35 | v59.05,46.35 57.78,47.62 v57.78,53.98 | v53.59,53.98 45.97,46.35 v45.47,46.35 | v41.27,46.35 37.8,42.88 37.33,42.88 30.48,36.03 30.48,25.4 v22.23,17.14
  Route15 2: v52.45,80.14 52.45,77.09 53.21,76.33 53.21,73.41 52.45,72.64 52.45,61.72 v56.39,57.78 | 46.23,76.71 46.86,77.34 v46.86,80.01 | 47.37,66.8 47.37,72.01 45.85,73.53 45.85,76.33 | v70.23,80.14 70.23,77.09 70.99,76.33 70.99,73.53 70.23,72.77 70.23,61.72 v74.17,57.78 | 64.01,76.71 64.64,77.34 v64.64,80.01 | 65.15,66.8 65.15,72.01 63.63,73.53 63.63,76.33 | v88.01,80.14 88.01,77.09 88.77,76.33 88.77,73.41 88.01,72.64 88.01,61.72 v91.95,57.78 | 81.79,76.71 82.3,77.22 v82.3,80.01 | 82.93,66.8 82.93,72.01 81.41,73.53 81.41,76.33 | v105.79,80.14 105.79,77.09 106.55,76.33 106.55,73.41 105.79,72.64 105.79,61.72 v109.73,57.78 | 99.57,76.71 100.08,77.22 v100.08,79.88 | 100.71,66.8 100.71,72.01 99.19,73.53 99.19,76.33 | v99.95,20.19 99.95,23.24 99.19,24 99.19,26.92 99.95,27.69 99.95,38.61 v96.01,42.55 | 106.17,23.62 105.41,22.86 v105.41,20.32 | 105.03,33.53 105.03,28.32 106.55,26.8 106.55,24 | v82.17,20.19 82.17,23.24 81.41,24 81.41,26.92 82.17,27.69 82.17,38.61 v78.23,42.55 | 88.39,23.62 87.88,23.11 v87.88,20.32 | 87.25,33.53 87.25,28.32 88.77,26.8 88.77,24 | v64.39,20.19 64.39,23.24 63.63,24 63.63,26.92 64.39,27.69 64.39,38.61 v60.45,42.55 | 70.61,23.62 70.36,23.37 v70.36,20.57 | 69.47,33.53 69.47,28.32 70.99,26.8 70.99,24 | v46.61,20.19 46.61,23.24 45.85,24 45.85,26.92 46.61,27.69 46.61,38.61 v42.67,42.55 | 52.83,23.62 52.45,23.24 v52.45,20.32 | 51.69,33.53 51.69,28.32 53.21,26.8 53.21,24
  pour Top (no thermals): 52.83,53.21 52.83,58.29 53.21,58.67 58.17,58.67 58.42,58.42 58.42,53.21
  pour Top (isolate 0.254, no thermals): 46.61,78.49 47.5,79.38 47.5,80.26 47.24,80.52 45.85,80.52 45.72,80.39 44.83,80.39 44.83,79.63 45.34,79.63 46.48,78.49
  pour Top (isolate 0.254, no thermals): 53.02,78.3 51.82,79.5 51.82,80.39 52.2,80.77 53.21,80.77 53.59,80.39 54.23,80.39 54.23,79.5
  pour Top (isolate 0.254, rank 2, no thermals): 45.85,71.5 44.83,70.48 44.83,69.47 45.59,69.47 46.35,70.23 46.35,71.25 46.1,71.5
  pour Top (isolate 0.254, rank 2, no thermals): 52.45,71.5 53.59,70.36 54.23,70.36 54.23,69.34 54.48,69.09 54.48,68.2 54.23,67.94 53.09,67.94 52.07,68.96 52.07,71.25 52.32,71.5
  pour Route15 (isolate 0.254, rank 2): 58.67,56.9 53.21,56.9 46.35,63.75 46.35,66.55 44.58,68.33 44.58,68.83 44.96,69.22 48.26,69.22 48.26,66.04 50.8,63.5 51.69,63.5 51.69,69.34 51.82,69.47 54.36,69.47 54.74,69.09 54.74,68.2 54.23,67.69 54.23,61.47 57.02,58.67 58.17,58.67 58.67,58.17
  pour Top (no thermals): 70.61,53.21 70.61,58.29 70.99,58.67 75.95,58.67 76.2,58.42 76.2,53.21
  pour Top (isolate 0.254, no thermals): 64.39,78.49 65.28,79.38 65.28,80.26 65.02,80.52 63.63,80.52 63.5,80.39 62.61,80.39 62.61,79.63 63.12,79.63 64.26,78.49
  pour Top (isolate 0.254, no thermals): 70.8,78.3 69.6,79.5 69.6,80.39 69.98,80.77 70.99,80.77 71.37,80.39 72.01,80.39 72.01,79.5
  pour Top (isolate 0.254, rank 2, no thermals): 63.63,71.5 62.61,70.48 62.61,69.47 63.37,69.47 64.14,70.23 64.14,71.25 63.88,71.5
  pour Top (isolate 0.254, rank 2, no thermals): 70.23,71.5 71.37,70.36 72.01,70.36 72.01,69.34 72.26,69.09 72.26,68.2 72.01,67.94 70.87,67.94 69.85,68.96 69.85,71.25 70.1,71.5
  pour Route15 (isolate 0.254, rank 2): 76.45,56.9 70.99,56.9 64.14,63.75 64.14,66.55 62.36,68.33 62.36,68.83 62.74,69.22 66.04,69.22 66.04,66.04 68.58,63.5 69.47,63.5 69.47,69.34 69.6,69.47 72.14,69.47 72.52,69.09 72.52,68.2 72.01,67.69 72.01,61.47 74.8,58.67 75.95,58.67 76.45,58.17
  pour Top (no thermals): 88.39,53.21 88.39,58.29 88.77,58.67 93.73,58.67 93.98,58.42 93.98,53.21
  pour Top (isolate 0.254, no thermals): 82.17,78.49 83.06,79.38 83.06,80.26 82.8,80.52 81.41,80.52 81.28,80.39 80.39,80.39 80.39,79.63 80.9,79.63 82.04,78.49
  pour Top (isolate 0.254, no thermals): 88.58,78.3 87.38,79.5 87.38,80.39 87.76,80.77 88.77,80.77 89.15,80.39 89.79,80.39 89.79,79.5
  pour Top (isolate 0.254, rank 2, no thermals): 81.41,71.5 80.39,70.48 80.39,69.47 81.15,69.47 81.92,70.23 81.92,71.25 81.66,71.5
  pour Top (isolate 0.254, rank 2, no thermals): 88.01,71.5 89.15,70.36 89.79,70.36 89.79,69.34 90.04,69.09 90.04,68.2 89.79,67.94 88.65,67.94 87.63,68.96 87.63,71.25 87.88,71.5
  pour Route15 (isolate 0.254, rank 2): 94.23,56.9 88.77,56.9 81.92,63.75 81.92,66.55 80.14,68.33 80.14,68.83 80.52,69.22 83.82,69.22 83.82,66.04 86.36,63.5 87.25,63.5 87.25,69.34 87.38,69.47 89.92,69.47 90.3,69.09 90.3,68.2 89.79,67.69 89.79,61.47 92.58,58.67 93.73,58.67 94.23,58.17
  pour Top (no thermals): 106.17,53.21 106.17,58.29 106.55,58.67 111.51,58.67 111.76,58.42 111.76,53.21
  pour Top (isolate 0.254, no thermals): 99.95,78.49 100.84,79.38 100.84,80.26 100.58,80.52 99.19,80.52 99.06,80.39 98.17,80.39 98.17,79.63 98.68,79.63 99.82,78.49
  pour Top (isolate 0.254, no thermals): 106.36,78.3 105.16,79.5 105.16,80.39 105.54,80.77 106.55,80.77 106.93,80.39 107.57,80.39 107.57,79.5
  pour Top (isolate 0.254, rank 2, no thermals): 99.19,71.5 98.17,70.48 98.17,69.47 98.93,69.47 99.69,70.23 99.69,71.25 99.44,71.5
  pour Top (isolate 0.254, rank 2, no thermals): 105.79,71.5 106.93,70.36 107.57,70.36 107.57,69.34 107.82,69.09 107.82,68.2 107.57,67.94 106.43,67.94 105.41,68.96 105.41,71.25 105.66,71.5
  pour Route15 (isolate 0.254, rank 2): 112.01,56.9 106.55,56.9 99.69,63.75 99.69,66.55 97.92,68.33 97.92,68.83 98.3,69.22 101.6,69.22 101.6,66.04 104.14,63.5 105.03,63.5 105.03,69.34 105.16,69.47 107.7,69.47 108.08,69.09 108.08,68.2 107.57,67.69 107.57,61.47 110.36,58.67 111.51,58.67 112.01,58.17
  pour Top (no thermals): 99.57,47.12 99.57,42.04 99.19,41.66 94.23,41.66 93.98,41.91 93.98,47.12
  pour Top (isolate 0.254, no thermals): 105.79,21.84 104.9,20.95 104.9,20.07 105.16,19.81 106.55,19.81 106.68,19.94 107.57,19.94 107.57,20.7 107.06,20.7 105.92,21.84
  pour Top (isolate 0.254, no thermals): 99.38,22.03 100.58,20.83 100.58,19.94 100.2,19.56 99.19,19.56 98.81,19.94 98.17,19.94 98.17,20.83
  pour Top (isolate 0.254, rank 2, no thermals): 106.55,28.83 107.57,29.84 107.57,30.86 106.81,30.86 106.05,30.1 106.05,29.08 106.3,28.83
  pour Top (isolate 0.254, rank 2, no thermals): 99.95,28.83 98.81,29.97 98.17,29.97 98.17,30.99 97.92,31.24 97.92,32.13 98.17,32.38 99.31,32.38 100.33,31.37 100.33,29.08 100.08,28.83
  pour Route15 (isolate 0.254, rank 2): 93.73,43.43 99.19,43.43 106.05,36.58 106.05,33.78 107.82,32 107.82,31.5 107.44,31.11 104.14,31.11 104.14,34.29 101.6,36.83 100.71,36.83 100.71,30.99 100.58,30.86 98.04,30.86 97.66,31.24 97.66,32.13 98.17,32.64 98.17,38.86 95.38,41.66 94.23,41.66 93.73,42.16
  pour Top (no thermals): 81.79,47.12 81.79,42.04 81.41,41.66 76.45,41.66 76.2,41.91 76.2,47.12
  pour Top (isolate 0.254, no thermals): 88.01,21.84 87.12,20.95 87.12,20.07 87.38,19.81 88.77,19.81 88.9,19.94 89.79,19.94 89.79,20.7 89.28,20.7 88.14,21.84
  pour Top (isolate 0.254, no thermals): 81.6,22.03 82.8,20.83 82.8,19.94 82.42,19.56 81.41,19.56 81.03,19.94 80.39,19.94 80.39,20.83
  pour Top (isolate 0.254, rank 2, no thermals): 88.77,28.83 89.79,29.84 89.79,30.86 89.03,30.86 88.27,30.1 88.27,29.08 88.52,28.83
  pour Top (isolate 0.254, rank 2, no thermals): 82.17,28.83 81.03,29.97 80.39,29.97 80.39,30.99 80.14,31.24 80.14,32.13 80.39,32.38 81.53,32.38 82.55,31.37 82.55,29.08 82.3,28.83
  pour Route15 (isolate 0.254, rank 2): 75.95,43.43 81.41,43.43 88.27,36.58 88.27,33.78 90.04,32 90.04,31.5 89.66,31.11 86.36,31.11 86.36,34.29 83.82,36.83 82.93,36.83 82.93,30.99 82.8,30.86 80.26,30.86 79.88,31.24 79.88,32.13 80.39,32.64 80.39,38.86 77.6,41.66 76.45,41.66 75.95,42.16
  pour Top (no thermals): 64.01,47.12 64.01,42.04 63.63,41.66 58.67,41.66 58.42,41.91 58.42,47.12
  pour Top (isolate 0.254, no thermals): 70.23,21.84 69.34,20.95 69.34,20.07 69.6,19.81 70.99,19.81 71.12,19.94 72.01,19.94 72.01,20.7 71.5,20.7 70.36,21.84
  pour Top (isolate 0.254, no thermals): 63.82,22.03 65.02,20.83 65.02,19.94 64.64,19.56 63.63,19.56 63.25,19.94 62.61,19.94 62.61,20.83
  pour Top (isolate 0.254, rank 2, no thermals): 70.99,28.83 72.01,29.84 72.01,30.86 71.25,30.86 70.48,30.1 70.48,29.08 70.74,28.83
  pour Top (isolate 0.254, rank 2, no thermals): 64.39,28.83 63.25,29.97 62.61,29.97 62.61,30.99 62.36,31.24 62.36,32.13 62.61,32.38 63.75,32.38 64.77,31.37 64.77,29.08 64.52,28.83
  pour Route15 (isolate 0.254, rank 2): 58.17,43.43 63.63,43.43 70.48,36.58 70.48,33.78 72.26,32 72.26,31.5 71.88,31.11 68.58,31.11 68.58,34.29 66.04,36.83 65.15,36.83 65.15,30.99 65.02,30.86 62.48,30.86 62.1,31.24 62.1,32.13 62.61,32.64 62.61,38.86 59.82,41.66 58.67,41.66 58.17,42.16
  pour Top (no thermals): 46.23,47.12 46.23,42.04 45.85,41.66 40.89,41.66 40.64,41.91 40.64,47.12
  pour Top (isolate 0.254, no thermals): 52.45,21.84 51.56,20.95 51.56,20.07 51.82,19.81 53.21,19.81 53.34,19.94 54.23,19.94 54.23,20.7 53.72,20.7 52.58,21.84
  pour Top (isolate 0.254, no thermals): 46.04,22.03 47.24,20.83 47.24,19.94 46.86,19.56 45.85,19.56 45.47,19.94 44.83,19.94 44.83,20.83
  pour Top (isolate 0.254, rank 2, no thermals): 53.21,28.83 54.23,29.84 54.23,30.86 53.47,30.86 52.7,30.1 52.7,29.08 52.96,28.83
  pour Top (isolate 0.254, rank 2, no thermals): 46.61,28.83 45.47,29.97 44.83,29.97 44.83,30.99 44.58,31.24 44.58,32.13 44.83,32.38 45.97,32.38 46.99,31.37 46.99,29.08 46.74,28.83
  pour Route15 (isolate 0.254, rank 2): 40.39,43.43 45.85,43.43 52.7,36.58 52.7,33.78 54.48,32 54.48,31.5 54.1,31.11 50.8,31.11 50.8,34.29 48.26,36.83 47.37,36.83 47.37,30.99 47.24,30.86 44.7,30.86 44.32,31.24 44.32,32.13 44.83,32.64 44.83,38.86 42.04,41.66 40.89,41.66 40.39,42.16
  pour Top (isolate 0.254, no thermals): 22.86,17.78 22.86,12.06 15.49,12.06 15.49,17.78
  pour Route15 (isolate 0.254, rank 4): -1.27,10.16 -1.27,17.78 17.4,17.78 21.59,21.97 21.59,40.01 36.83,55.24 113.03,55.24 113.03,45.09 50.16,45.09 43.81,38.73 43.81,29.84 40.64,26.67 40.64,10.16
  pour Bottom: 15.88,17.4 15.88,12.45 18.41,12.45 18.41,12.06 19.81,12.06 19.81,12.45 21.84,12.45 21.84,16.89 22.48,16.89 22.48,17.4 19.81,17.4 19.81,17.78 18.54,17.78 18.54,17.4
  pour Route2: 15.88,17.4 15.88,12.45 18.41,12.45 18.41,12.06 19.81,12.06 19.81,12.45 21.84,12.45 21.84,16.89 22.48,16.89 22.48,17.4 19.81,17.4 19.81,17.78 18.54,17.78 18.54,17.4
74HC165_CS  (via drill 0.3, 0.35)
  Top 0.254: U5.47 22.57,44.92 21.93,45.56 v20.61,45.56 | v16.19,39.25 16.19,39.17 14.44,37.43 U1.1 | v41.91,50.8 41.91,50.04 38.61,46.74 v38.61,45.59
  Top 0.305: U3.1 111.97,64.56 116.59,59.94 116.59,50.8 | U4.1 111.97,23.33 112.94,24.29 115.99,24.29 117.6,25.91 117.6,29.59 116.59,30.61 116.59,50.8 | 116.59,50.8 v105.41,50.8
  Route2 0.254: v16.19,39.25 16.26,39.32 16.26,39.94 20.61,44.29 v20.61,45.56 20.61,47.53 21.48,48.41 26.52,48.41 27.56,47.37 38.1,47.37 38.61,46.86 v38.61,45.59
  Route2 0.305: v105.41,50.8 v41.91,50.8
74HC165_MISO  (via drill 0.3)
  Top 0.254: U4.7 115.92,21.81 arc45 116.33,20.83 117.02,20.14 arc-45 v117.68,18.54 | v22.75,46.99 23.01,47.25 23.01,50.97 22.57,51.41 U5.14
  Route2 0.254: v22.75,46.99 22.1,46.34 22.1,41.66 23.37,40.39 32.64,40.39 36.32,36.7 v38.23,36.7
  Route15 0.254: v117.68,18.54 117.68,17.91 118.11,17.48 118.11,13.47 arc-45 117.47,11.94 117.2,11.67 arc-45 115.41,10.92 43.85,10.92 arc-45 42.05,11.67 40.62,13.1 arc-45 39.88,14.89 39.88,35.05 v38.23,36.7
74HC165_SCK  (via drill 0.3, 0.35)
  Top 0.254: U5.16 21.57,51.55 22.53,50.59 22.53,47.93 v21.89,47.29 | v16.89,38.64 16.67,38.64 15.11,37.08 15.11,36.47 U1.2 | v40.64,50.8 40.64,49.4 37.82,46.58 v37.82,46.35
  Top 0.305: U3.2 112.67,65.12 117.35,60.45 v117.35,52.07 117.35,32.39 117.18,32.22 117.18,31.03 118.11,30.1 118.11,25.78 116.08,23.75 113.03,23.75 112.67,23.39 U4.2
  Route2 0.254: v16.89,38.64 16.92,38.67 16.92,39.75 18.67,41.5 20.01,41.5 21.38,42.88 21.38,46.78 v21.89,47.29 21.89,47.37 22.52,48 26.36,48 27.39,46.97 37.21,46.97 v37.82,46.35
  Route2 0.305: v104.14,52.07 103.63,51.56 41.4,51.56 v40.64,50.8
  Route15 0.305: v117.35,52.07 v104.14,52.07
!RESET  (via drill 0.3, 0.35)
  Top 0.254: U5.40 19.07,48.03 v19.94,48.9 | SWD.P$10 30.73,44.15 v30.73,48.15
  Top 0.305: R1.1 22.99,61.34 22.99,60.45 v23.11,60.33 | RESET.3 20.45,58.93 v20.45,58.17 20.51,58.1 17.91,55.5 v17.91,53.85
  Route2 0.254: v30.73,48.15 30.35,47.77 27.94,47.77 26.81,48.9 v19.94,48.9
  Route2 0.305: v23.11,60.33 22.48,60.33 20.45,58.29 v20.45,58.17 | v19.94,48.9 19.94,49.02 18.8,50.16 18.8,52.44 17.91,53.33 v17.91,53.85
+3V3A  (via drill 0.3, 0.35)
  Top 0.254: IC2.8 32.27,66.73 C16.1 | IC2.11 30.77,65.04 29.34,66.47 C17.1 | IC2.4 34.27,66.74 C15.1 | IC2.21 27.28,58.44 C22.1 | IC2.17 27.57,60.44 27.05,60.96 C21.1 | C18.1 27.59,62.12 27.59,61.63 27.78,61.44 IC2.15
  Top 0.305: C16.1 32.89,66.85 33.27,67.23 v33.27,67.31 33.48,67.1 33.91,67.1 C15.1 | C17.1 v29.34,65.66 C19.1 | C22.1 26.5,57.83 v25.91,58.42 | v26.31,61.62 26.62,61.3 C21.1 | C18.1 25.7,63.04 v25.65,62.99 | R6.2 21.08,66.42 v21.08,65.41 | RN5.2 RN5.1 | v21.97,68.96 21.97,71.76 v22.86,72.64
  Top 0.406: v22.86,80.01 22.64,80.22 RN5.1
  Top 0.508: L2.2 23.75,66.42 24.51,65.66 C19.1 26.67,66.17 v27.3,66.8
  Route15 0.305: v29.34,65.66 31.62,65.66 v33.27,67.31 | v25.91,58.42 25.91,61.23 v26.31,61.62 26.31,62.34 v25.65,62.99 26.04,63.37 26.04,65.53 | v21.08,65.41 21.21,65.53 21.59,65.53 | 21.59,65.53 26.04,65.53 | 26.04,65.53 v27.3,66.8 | 21.59,65.53 21.59,68.7 21.85,68.96 v21.97,68.96
  Route15 0.406: v22.86,72.64 v22.86,80.01
  pour Route15 (isolate 0.254, rank 2): 35.56,67.31 20.32,67.31 20.32,64.77 24.13,64.77 24.13,57.15 26.67,57.15 26.67,64.77 35.56,64.77
+3V3D  (via drill 0.3, 0.35)
  Top 0.254: IC2.28 31.77,54.5 31.11,53.85 C25.2 | IC2.45 IC2.44 | IC2.44 IC2.43 | IC2.44 38.85,60.44 39.37,60.96 39.37,63.12 39.24,63.25
  Top 0.508: L3.2 38.99,69.79 40.03,68.75 40.03,66.32 C20.1 39.24,63.25 v39.24,63.12 | v29.59,52.96 29.59,53.77 C25.2
  Route15 0.508: v39.24,63.12 38.73,63.12 29.59,53.98 v29.59,52.96
ACT  (via drill 0.35)
  Top 0.254: IC2.27 31.27,56.39 31.02,56.65 31.02,57.88 v30.48,58.42
  Top 0.305: X3.10 4.71,64.77 8.31,64.77 9.13,63.95 10.94,63.95 11.76,64.77 v16.1,64.77
  Route2 0.305: v30.48,58.42 27.18,58.42 26.04,57.28 19.17,57.28 18.66,57.78 v18.54,57.78
  Route15 0.305: v18.54,57.78 16.1,60.23 v16.1,64.77
BUSY1  (via drill 0.3)
  Top 0.254: BUSY1.C 43.8,74.8 v43.86,74.8 | v49.04,76.86 49.2,77.03 U7.22 49.2,78.75 48.81,79.14 48.81,83.61 49.53,84.33 v49.53,88.39 | U3.11 115.28,79.08 116.2,80.01 v116.2,80.14
  Route2 0.254: v49.04,76.86 45.92,76.86 v43.86,74.8 | v49.53,88.39 50.23,89.09 112.31,89.09 112.79,88.61 112.79,87.9 112.29,87.4 112.29,84.98 116.2,81.07 v116.2,80.14
BUSY2  (via drill 0.3)
  Top 0.254: v66.82,76.86 66.98,77.03 U8.22 66.98,78.69 66.68,79 66.68,82.55 66.55,82.68 66.55,84.2 67.31,84.96 67.31,87.63 68.39,88.71 110.72,88.71 v111.1,88.33 | v61.85,74.8 61.85,73.93 BUSY2.C | U3.13 113.97,79.3 v114.55,79.88
  Route2 0.254: v66.82,76.86 66.74,76.78 63.32,76.78 61.85,75.31 v61.85,74.8
  Route15 0.254: v114.55,79.88 112.54,81.89 112.54,86.86 111.1,88.31 v111.1,88.33
BUSY3  (via drill 0.3)
  Top 0.254: v84.6,76.86 v84.61,76.86 84.77,77.02 U9.22 84.77,78.82 84.38,79.2 84.38,84.15 85.09,84.86 85.09,87.63 85.76,88.3 108.42,88.3 v109.98,86.74 | v79.76,75.17 79.36,74.78 BUSY3.C | U3.3 113.33,74.42 v113.84,74.93
  Route2 0.254: v84.6,76.86 84.26,76.53 80.99,76.53 79.76,75.29 v79.76,75.17 | v113.84,74.93 113.44,75.33 113.44,80.71 110.11,84.04 110.11,86.61 v109.98,86.74
BUSY4  (via drill 0.3)
  Top 0.254: U3.5 114.62,74.24 v115.7,75.31 | v117.26,76.58 117.45,76.77 117.45,79.96 115.62,81.79 103.47,81.79 103.25,82.01 102.62,82.01 102.24,81.63 102.24,78.87 102.55,78.56 U10.22 102.55,77.03 v102.38,76.86 | v97.28,75.17 97.28,73.8 BUSY4.C
  Route2 0.254: v115.7,75.31 116.97,76.58 v117.26,76.58 | v102.38,76.86 98.97,76.86 v97.28,75.17
BUSY5  (via drill 0.3)
  Top 0.254: U4.11 115.28,27.6 115.99,26.88 115.99,26.14 115.61,25.76 115.34,25.76 114.94,25.36 113.4,25.36 113.04,25.72 109.54,25.72 BUSY5.C 108.6,26.01 108.58,26.01 v108.2,25.63 | U11.22 103.19,23.3 v103.36,23.47
  Route2 0.254: v103.36,23.47 103.44,23.55 106.59,23.55 108.2,25.16 v108.2,25.63
BUSY6  (via drill 0.3)
  Top 0.254: BUSY6.C 90.81,26.66 v90.81,25.16 | v94.11,12.32 93.73,12.32 92.43,13.61 92.43,16.72 90.99,18.16 86.26,18.16 85.79,18.64 85.79,21.27 85.42,21.64 U12.22 85.42,23.41 v85.47,23.47 | v114.43,26.67 113.97,27.12 U4.13
  Route2 0.254: v94.11,12.32 94.87,11.56 110.49,11.56 112.36,13.43 112.36,15.62 114.55,17.82 114.55,26.54 v114.43,26.67 | v85.47,23.47 89.12,23.47 v90.81,25.16
BUSY7  (via drill 0.3)
  Top 0.254: U4.3 113.33,20.49 110.24,17.4 110.24,14.42 109.92,14.1 109.92,12.64 108.57,11.29 76.58,11.29 74.65,13.22 74.65,17.42 73.91,18.16 68.58,18.16 67.94,18.8 67.94,21.46 67.64,21.77 U13.22 67.64,23.3 v67.8,23.47 | v72.9,25.4 73.04,25.54 BUSY7.C
  Route2 0.254: v67.8,23.47 72.37,23.47 72.9,24 v72.9,25.4
BUSY8  (via drill 0.3)
  Top 0.254: U4.5 114.62,20.26 111.38,17.02 111.38,13.46 108.8,10.88 59.22,10.88 56.9,13.21 56.9,15.81 55.08,17.63 51.21,17.63 50.16,18.67 50.16,21.46 49.85,21.77 U14.22 49.85,23.3 v50.02,23.47 | v55.24,25.4 55.24,26.66 BUSY8.C
  Route2 0.254: v50.02,23.47 50.05,23.5 53.72,23.5 55.24,25.02 v55.24,25.4
D13
  Top 0.254: U5.26 15.12,50.51
  Top 0.305: RN3.6 11.03,56.66 11.43,56.26 12.32,56.26 13.84,54.74 13.84,51.78 15.12,50.51
D+1
  Top 0.254: U2.6 8.85,53.67 8.27,53.67 7.62,54.33 7.62,56.39 5.59,58.42 J1.3
FLAG1  (via drill 0.3)
  Top 0.254: v45.66,84.65 45.66,82.74 47.91,80.49 U7.24 47.91,77.27 47.32,76.69 44.29,76.69 FLAG1.C | v47.24,88.33 47.62,88.33 48.41,89.11 111.35,89.11 112.08,88.38 v112.08,88.32 | v115.32,80.39 115.32,79.71 114.62,79.02 U3.12
  Route2 0.254: v45.66,84.65 45.66,85.29 46.9,86.53 46.9,88.11 47.12,88.33 v47.24,88.33 | v112.08,88.32 111.83,88.07 111.83,84.89 115.44,81.28 115.44,80.52 v115.32,80.39
FLAG2  (via drill 0.3, 0.35)
  Top 0.254: FLAG2.C 62.1,76.2 62.67,76.77 65.34,76.77 65.69,77.11 U8.24 65.69,80.52 63.5,82.71 v63.5,84.7 | U3.14 113.33,79.73 v114.6,81
  Route2 0.254: v63.5,84.7 63.5,85.35 64.68,86.53 64.68,87.54 65.85,88.71 109.67,88.71 111.32,87.05 111.32,84.28 v114.6,81
FLAG3  (via drill 0.3)
  Top 0.254: FLAG3.C 79.94,76.77 83,76.77 83.47,77.24 U9.24 83.47,80.49 81.21,82.75 81.21,84.61 v81.28,84.67 | U3.4 113.97,74.14 114.49,74.66 114.49,75.25 v114.68,75.44